# EAGLE board EEZ XMOS eval r1B5 (EAGLE 6.1), part 1 of 2
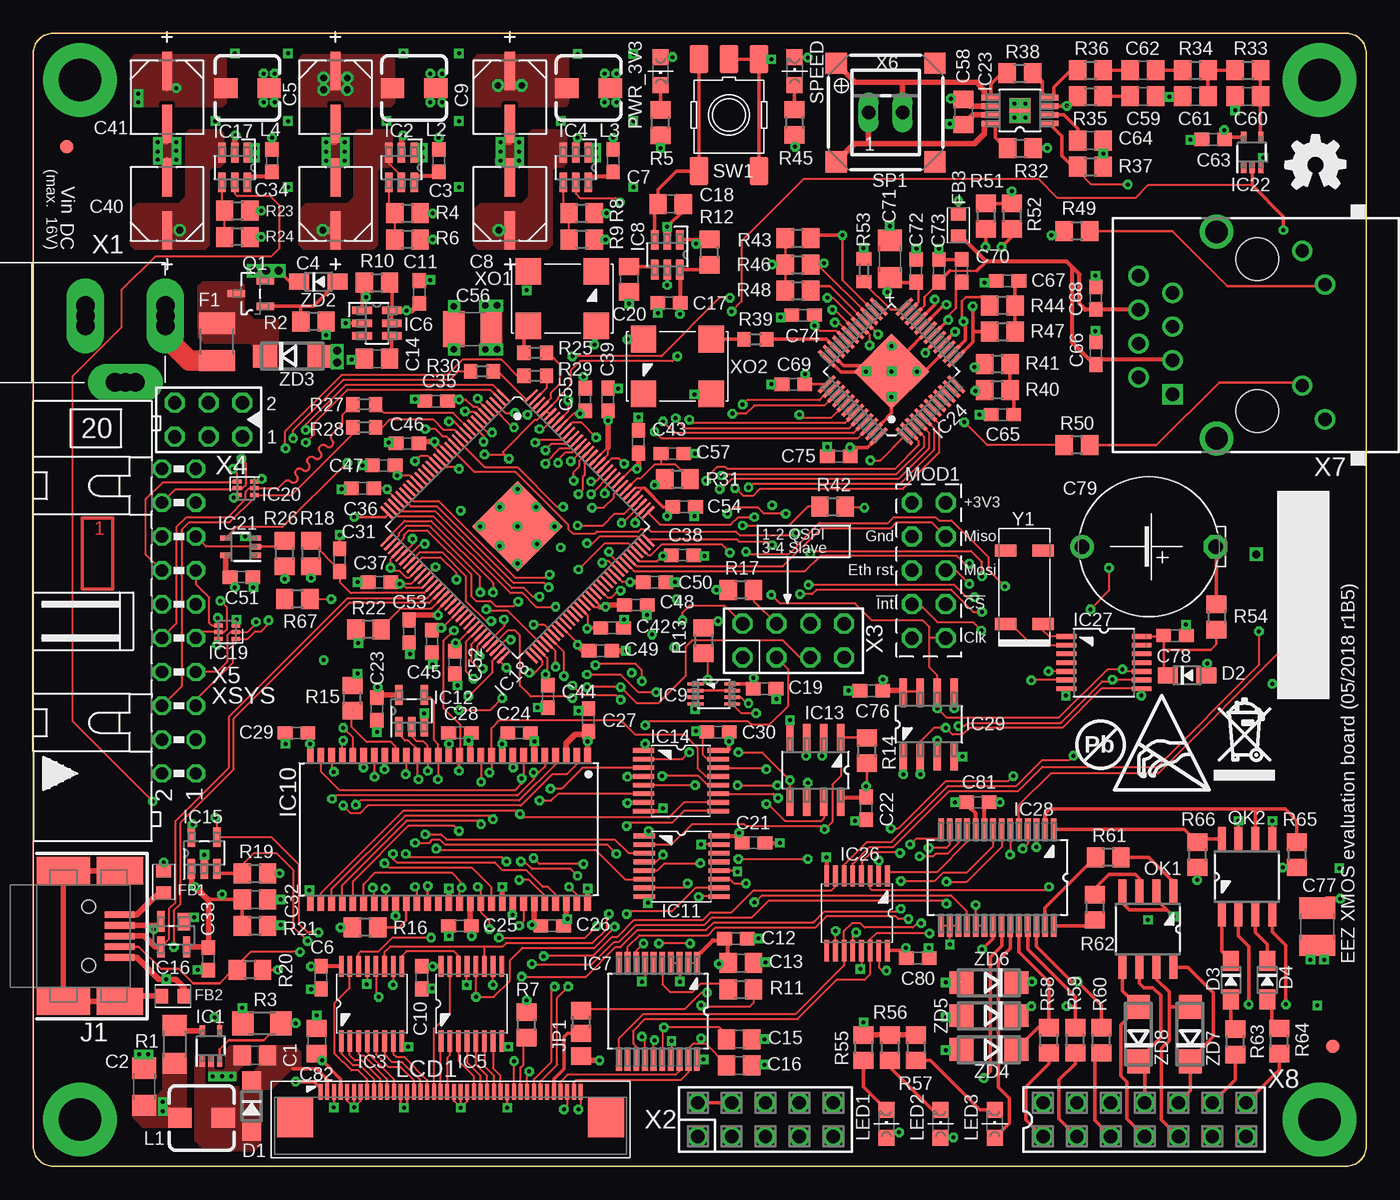
[diagram p5: board, top side]
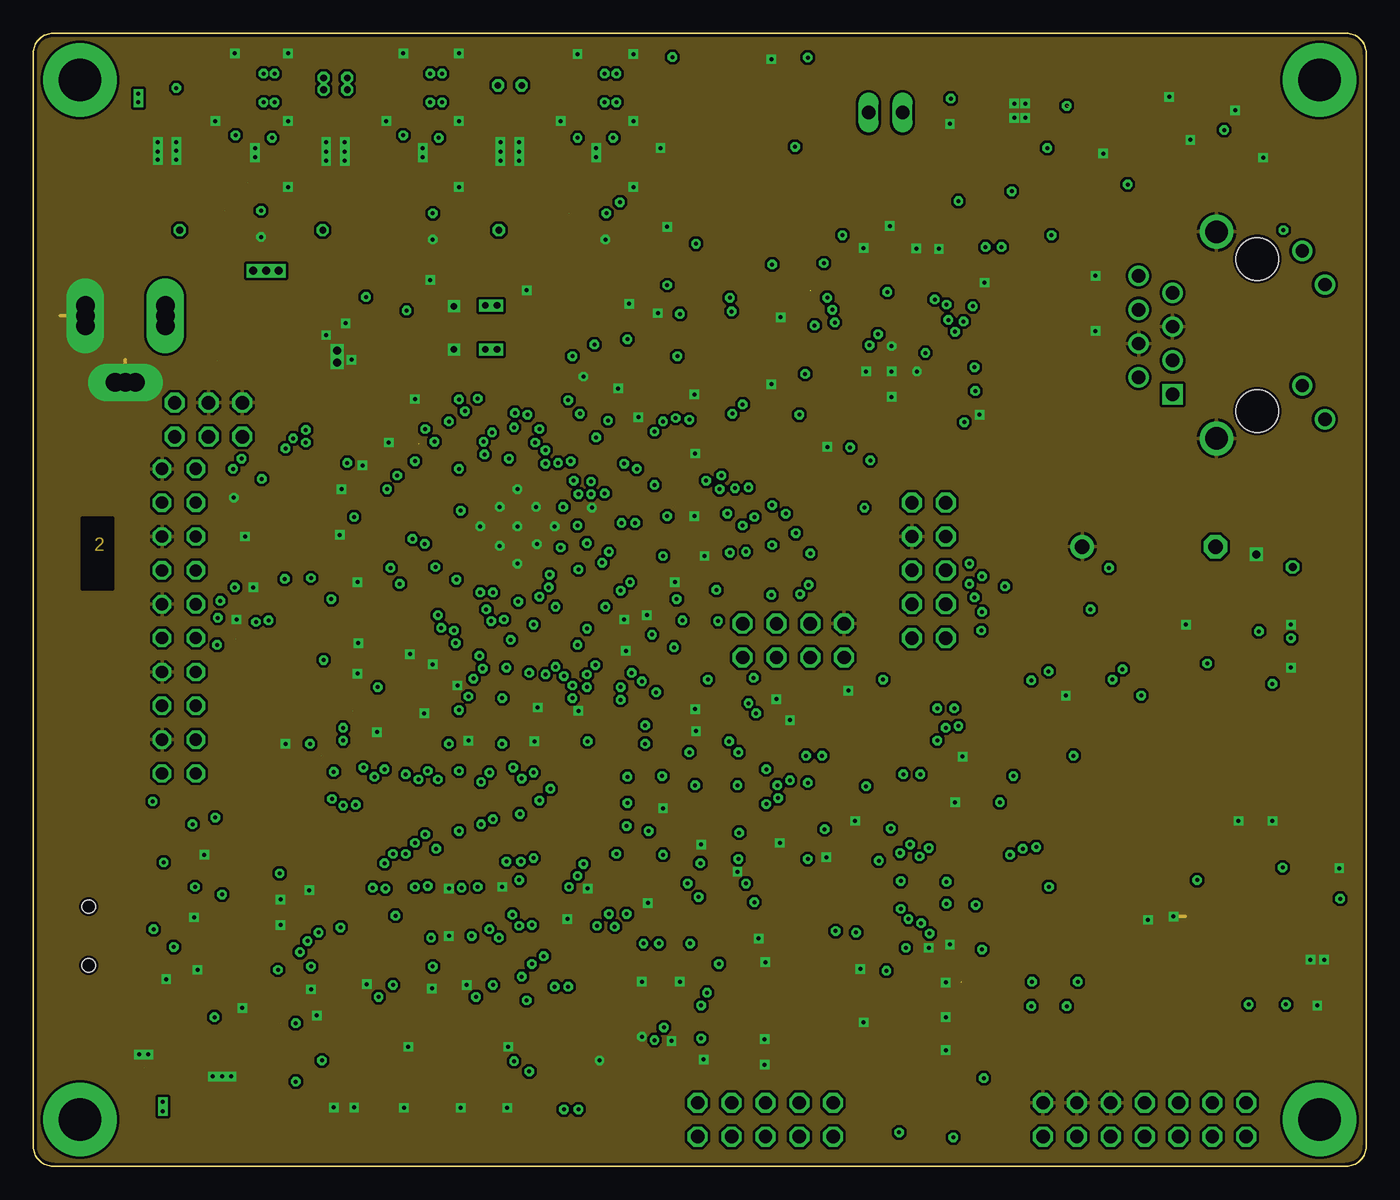
[diagram p6: board, inner layer Ground]
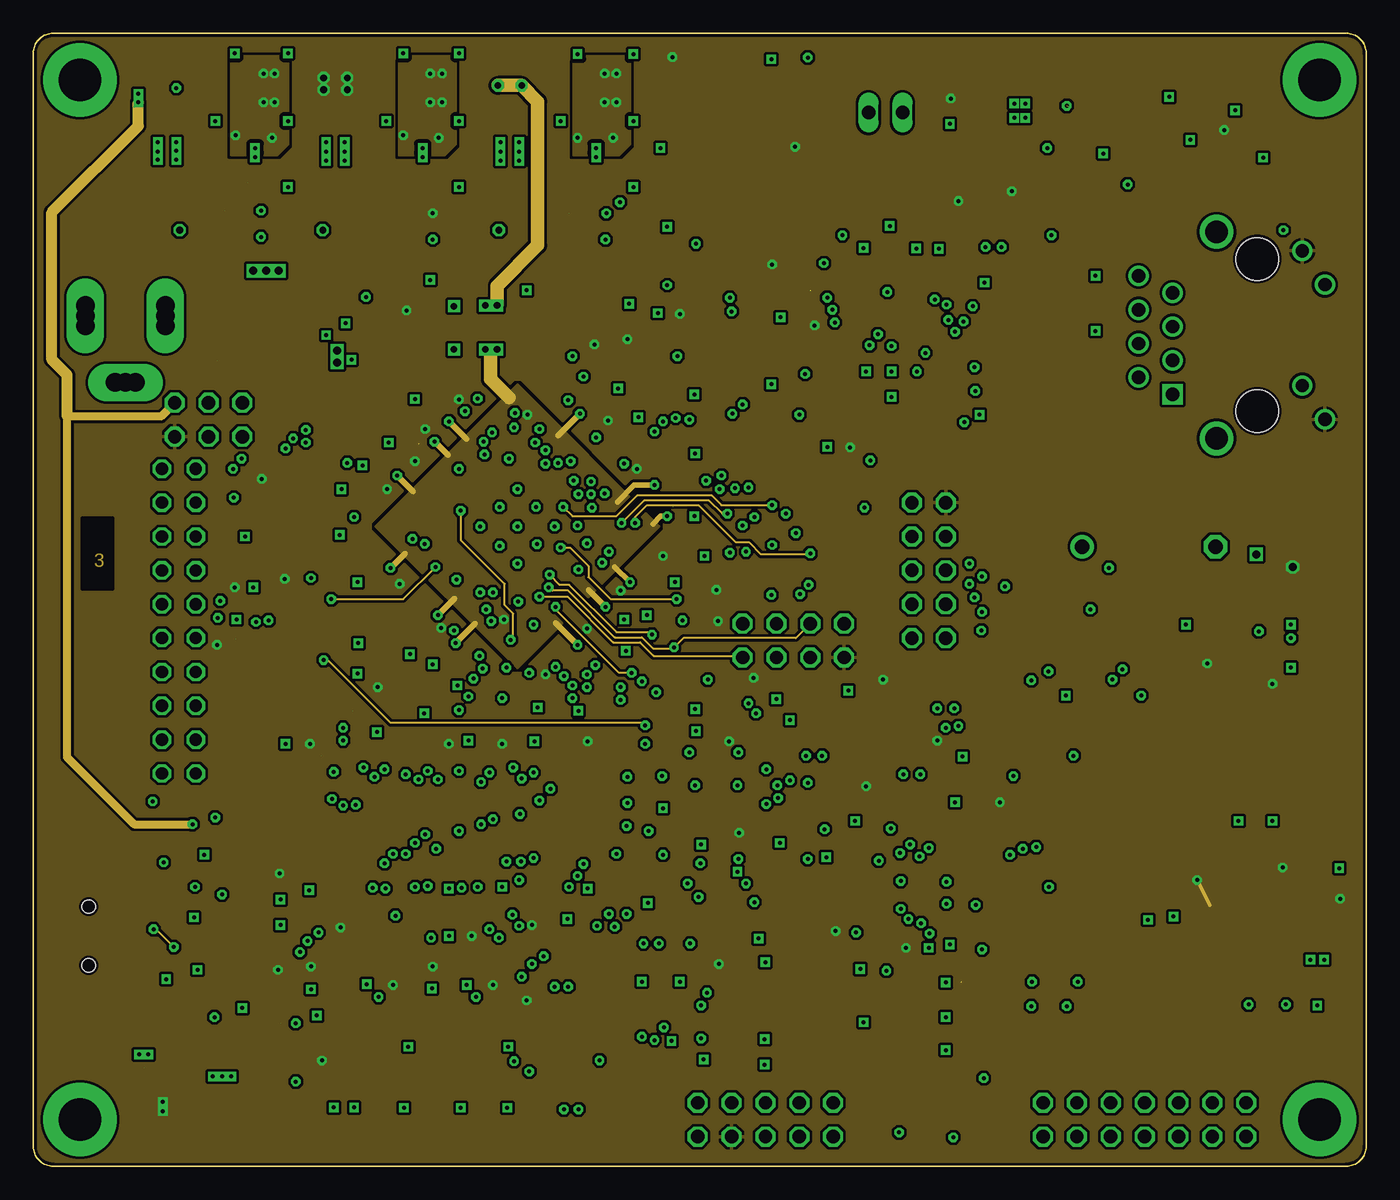
[diagram p7: board, inner layer Power]
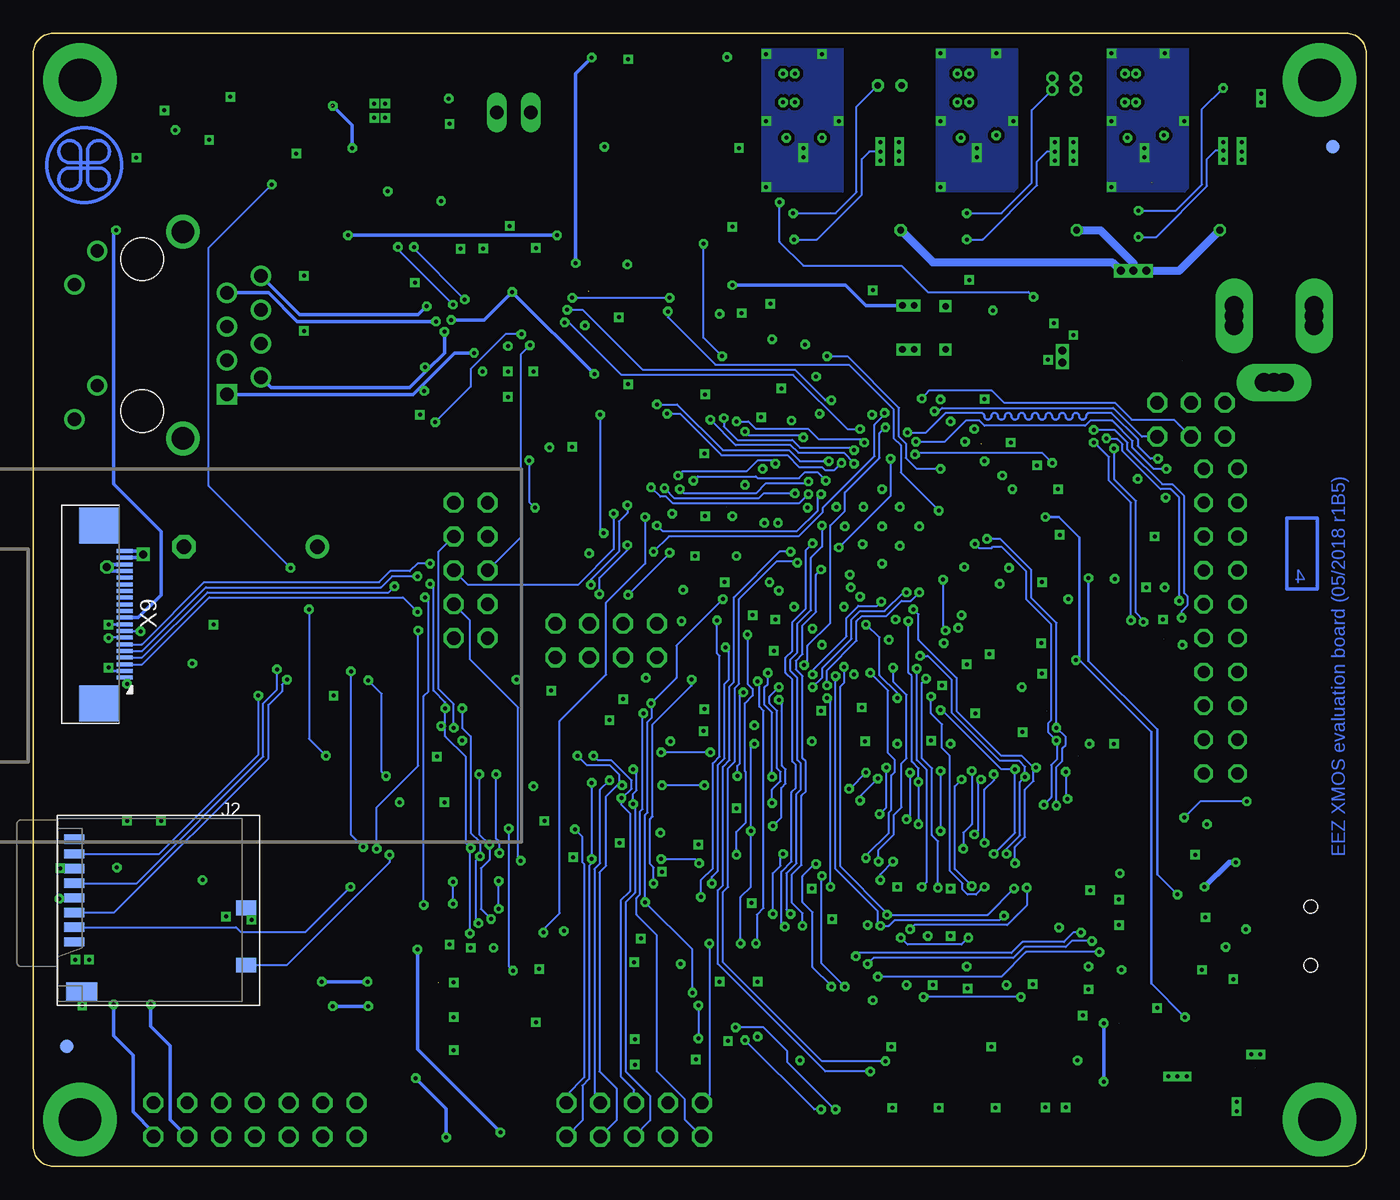
[diagram p8: board, bottom side, seen from below]

Size 100 x 85 mm. Coordinates in mm from the lower left corner, seen from the top.
Outline: 100,83.5 100,1.5 arc-90 98.5,0 1.5,0 arc-90 0,1.5 0,83.5 arc-90 1.5,85 98.5,85 arc-90 100,83.5
Copper layers (1*2*15*16): Top 0.035mm / dielectric 0.35mm / Ground 0.035mm / dielectric 0.71mm / Power 0.035mm / dielectric 0.35mm / Bottom 0.035mm
Design rules: minimum track width 6mil, minimum drill 11.5mil, track to track 6mil, track to pad 6mil, pad to pad 5mil, via to via 6mil, smd to smd 5mil, copper to edge 6mil, drill to drill 6mil, minimum pad ring 4mil, minimum via ring 8mil, stop-mask expansion 2mil, vias tented up to drill 25mil, thermal gap 8mil
Net classes: 0 default: width 0.152 mm, drill 0.3 mm, clearance 0.203 mm; 1 dgnd: width 0.152 mm, drill 0.3 mm, clearance 0.203 mm; 2 gnd: width 0.152 mm, drill 0.3 mm, clearance 0.203 mm

## Footprints (pad centres in the part's own frame; a part is rotated, then mirrored left to right if it is on the bottom)
C0805 = smd 1.3 x 1.5: 1 -0.95,0; 2 0.95,0
C1206 = smd 1.6 x 1.8: 1 -1.4,0; 2 1.4,0
C0603 = smd 1.1 x 1: 1 -0.85,0; 2 0.85,0
CAPAE530X610N = smd 2.87 x 0.762: 1 -1.981,0; 2 1.981,0
C1210 = smd 1.6 x 2.7: 1 -1.4,0; 2 1.4,0
EC1206 = smd 1.6 x 1.8: + -1.4,0; - 1.4,0
SG-R10MM = drill 1.1 pad 1.778 octagon: 1 5,0 | drill 1.1 pad 1.778: 2 -5,0
SOD123 = smd 1.4 x 1.4: A 1.9,0; C -1.9,0
SOD323-W = smd 1.5 x 1.2: A 1.45,0; C -1.45,0
F1210 = smd 1.6 x 2.7: 1 -1.4,0; 2 1.4,0
BEAD0603 = smd 1 x 1.1: P$1 -0.85,0; P$2 0.85,0
FIDUCIAL_DUAL = smd 1.016 x 1.016 bottom: B 0,0 | smd 1.016 x 1.016: T 0,0
DCK0005A_N = smd 0.85 x 0.4: 1 -1.125,0.65; 2 -1.125,0; 3 -1.125,-0.65; 4 1.125,-0.65; 5 1.125,0.65
DBV6 = smd 1.473 x 0.559: 1 -1.118,0.95; 2 -1.118,0; 3 -1.118,-0.95; 4 1.118,-0.95; 5 1.118,0; 6 1.118,0.95
PW(R-PDSO-G16) = smd 1.6 x 0.35: 1 -2.8,2.3; 2 -2.8,1.65; 3 -2.8,1; 4 -2.8,0.35; 5 -2.8,-0.3; 6 -2.8,-0.95; 7 -2.8,-1.6; 8 -2.8,-2.25; 9 2.8,-2.25; 10 2.8,-1.6; 11 2.8,-0.95; 12 2.8,-0.3; 13 2.8,0.35; 14 2.8,1; 15 2.8,1.65; 16 2.8,2.3
SOP65P780X200-20N = smd 1.651 x 0.432: 1 -3.632,2.921; 2 -3.632,2.286; 3 -3.632,1.626; 4 -3.632,0.965; 5 -3.632,0.33; 6 -3.632,-0.33; 7 -3.632,-0.965; 8 -3.632,-1.626; 9 -3.632,-2.286; 10 -3.632,-2.921; 11 3.632,-2.921; 12 3.632,-2.286; 13 3.632,-1.626; 14 3.632,-0.965; 15 3.632,-0.33; 16 3.632,0.33; 17 3.632,0.965; 18 3.632,1.626; 19 3.632,2.286; 20 3.632,2.921
DCU8 = smd 1.168 x 0.254: 1 -1.372,0.75; 2 -1.372,0.25; 3 -1.372,-0.25; 4 -1.372,-0.75; 5 1.372,-0.75; 6 1.372,-0.25; 7 1.372,0.25; 8 1.372,0.75
TSOPII-54 = smd 1.2 x 0.5: 1 -5.502,10.4; 2 -5.502,9.6; 3 -5.502,8.8; 4 -5.502,8; 5 -5.502,7.2; 6 -5.502,6.4; 7 -5.502,5.6; 8 -5.502,4.8; 9 -5.502,4; 10 -5.502,3.2; 11 -5.502,2.4; 12 -5.502,1.6; 13 -5.502,0.8; 14 -5.502,0; 15 -5.502,-0.8; 16 -5.502,-1.6; 17 -5.502,-2.4; 18 -5.502,-3.2; 19 -5.502,-4; 20 -5.502,-4.8; 21 -5.502,-5.6; 22 -5.502,-6.4; 23 -5.502,-7.2; 24 -5.502,-8; 25 -5.502,-8.8; 26 -5.502,-9.6; 27 -5.502,-10.4; 28 5.502,-10.4; 29 5.502,-9.6; 30 5.502,-8.8; 31 5.502,-8; 32 5.502,-7.2; 33 5.502,-6.4; 34 5.502,-5.6; 35 5.502,-4.8; 36 5.502,-4; 37 5.502,-3.2; 38 5.502,-2.4; 39 5.502,-1.6; 40 5.502,-0.8; 41 5.502,0; 42 5.502,0.8; 43 5.502,1.6; 44 5.502,2.4; 45 5.502,3.2; 46 5.502,4; 47 5.502,4.8; 48 5.502,5.6; 49 5.502,6.4; 50 5.502,7.2; 51 5.502,8; 52 5.502,8.8; 53 5.502,9.6; 54 5.502,10.4
DBV5 = smd 1.473 x 0.559: 1 -1.194,0.95; 2 -1.194,0; 3 -1.194,-0.95; 4 1.194,-0.95; 5 1.194,0.95
SOIC127P600X175-8N = smd 1.981 x 0.559: 1 -2.464,1.905; 2 -2.464,0.635; 3 -2.464,-0.635; 4 -2.464,-1.905; 5 2.464,-1.905; 6 2.464,-0.635; 7 2.464,0.635; 8 2.464,1.905
SOP192P292X122-4N = smd 0.94 x 1.321: 1 -0.762,-1.016 | smd 0.559 x 1.575: 2 0.965,-1.016; 3 0.965,0.889; 4 -0.965,0.889
TQ128 = smd 1.3 x 0.18: 1 -7.65,6.2; 2 -7.65,5.8; 3 -7.65,5.4; 4 -7.65,5; 5 -7.65,4.6; 6 -7.65,4.2; 7 -7.65,3.8; 8 -7.65,3.4; 9 -7.65,3; 10 -7.65,2.6; 11 -7.65,2.2; 12 -7.65,1.8; 13 -7.65,1.4; 14 -7.65,1; 15 -7.65,0.6; 16 -7.65,0.2; 17 -7.65,-0.2; 18 -7.65,-0.6; 19 -7.65,-1; 20 -7.65,-1.4; 21 -7.65,-1.8; 22 -7.65,-2.2; 23 -7.65,-2.6; 24 -7.65,-3; 25 -7.65,-3.4; 26 -7.65,-3.8; 27 -7.65,-4.2; 28 -7.65,-4.6; 29 -7.65,-5; 30 -7.65,-5.4; 31 -7.65,-5.8; 32 -7.65,-6.2; 65 7.65,-6.2; 66 7.65,-5.8; 67 7.65,-5.4; 68 7.65,-5; 69 7.65,-4.6; 70 7.65,-4.2; 71 7.65,-3.8; 72 7.65,-3.4; 73 7.65,-3; 74 7.65,-2.6; 75 7.65,-2.2; 76 7.65,-1.8; 77 7.65,-1.4; 78 7.65,-1; 79 7.65,-0.6; 80 7.65,-0.2; 81 7.65,0.2; 82 7.65,0.6; 83 7.65,1; 84 7.65,1.4; 85 7.65,1.8; 86 7.65,2.2; 87 7.65,2.6; 88 7.65,3; 89 7.65,3.4; 90 7.65,3.8; 91 7.65,4.2; 92 7.65,4.6; 93 7.65,5; 94 7.65,5.4; 95 7.65,5.8; 96 7.65,6.2 | smd 0.18 x 1.3: 33 -6.2,-7.65; 34 -5.8,-7.65; 35 -5.4,-7.65; 36 -5,-7.65; 37 -4.6,-7.65; 38 -4.2,-7.65; 39 -3.8,-7.65; 40 -3.4,-7.65; 41 -3,-7.65; 42 -2.6,-7.65; 43 -2.2,-7.65; 44 -1.8,-7.65; 45 -1.4,-7.65; 46 -1,-7.65; 47 -0.6,-7.65; 48 -0.2,-7.65; 49 0.2,-7.65; 50 0.6,-7.65; 51 1,-7.65; 52 1.4,-7.65; 53 1.8,-7.65; 54 2.2,-7.65; 55 2.6,-7.65; 56 3,-7.65; 57 3.4,-7.65; 58 3.8,-7.65; 59 4.2,-7.65; 60 4.6,-7.65; 61 5,-7.65; 62 5.4,-7.65; 63 5.8,-7.65; 64 6.2,-7.65; 97 6.2,7.65; 98 5.8,7.65; 99 5.4,7.65; 100 5,7.65; 101 4.6,7.65; 102 4.2,7.65; 103 3.8,7.65; 104 3.4,7.65; 105 3,7.65; 106 2.6,7.65; 107 2.2,7.65; 108 1.8,7.65; 109 1.4,7.65; 110 1,7.65; 111 0.6,7.65; 112 0.2,7.65; 113 -0.2,7.65; 114 -0.6,7.65; 115 -1,7.65; 116 -1.4,7.65; 117 -1.8,7.65; 118 -2.2,7.65; 119 -2.6,7.65; 120 -3,7.65; 121 -3.4,7.65; 122 -3.8,7.65; 123 -4.2,7.65; 124 -4.6,7.65; 125 -5,7.65; 126 -5.4,7.65; 127 -5.8,7.65; 128 -6.2,7.65 | smd 4.8 x 4.8: PAD 0,0
DRL6 = smd 0.654 x 0.301: 1 -0.65,0.5; 2 -0.65,0; 3 -0.65,-0.5; 4 0.65,-0.5; 5 0.65,0; 6 0.65,0.5
DCK5 = smd 0.85 x 0.4: 1 -1.125,0.65; 2 -1.125,0; 3 -1.125,-0.65; 4 1.125,-0.65; 5 1.125,0.65
SOP65P490X110-9N = smd 1.422 x 0.432: 1 -2.184,0.965; 2 -2.184,0.33; 3 -2.184,-0.33; 4 -2.184,-0.965; 5 2.184,-0.965; 6 2.184,-0.33; 7 2.184,0.33; 8 2.184,0.965 | smd 1.575 x 1.88: TP 0,0
PT48+PAD = smd 1.676 x 0.279: 1 -4.115,2.75; 2 -4.115,2.25; 3 -4.115,1.75; 4 -4.115,1.25; 5 -4.115,0.75; 6 -4.115,0.25; 7 -4.115,-0.25; 8 -4.115,-0.75; 9 -4.115,-1.25; 10 -4.115,-1.75; 11 -4.115,-2.25; 12 -4.115,-2.75; 25 4.115,-2.75; 26 4.115,-2.25; 27 4.115,-1.75; 28 4.115,-1.25; 29 4.115,-0.75; 30 4.115,-0.25; 31 4.115,0.25; 32 4.115,0.75; 33 4.115,1.25; 34 4.115,1.75; 35 4.115,2.25; 36 4.115,2.75 | smd 0.279 x 1.676: 13 -2.75,-4.115; 14 -2.25,-4.115; 15 -1.75,-4.115; 16 -1.25,-4.115; 17 -0.75,-4.115; 18 -0.25,-4.115; 19 0.25,-4.115; 20 0.75,-4.115; 21 1.25,-4.115; 22 1.75,-4.115; 23 2.25,-4.115; 24 2.75,-4.115; 37 2.75,4.115; 38 2.25,4.115; 39 1.75,4.115; 40 1.25,4.115; 41 0.75,4.115; 42 0.25,4.115; 43 -0.25,4.115; 44 -0.75,4.115; 45 -1.25,4.115; 46 -1.75,4.115; 47 -2.25,4.115; 48 -2.75,4.115 | smd 4 x 4: PAD 0,0
SOP65P640X120-14N = smd 1.473 x 0.356: 1 -2.819,1.956; 2 -2.819,1.295; 3 -2.819,0.66; 4 -2.819,0; 5 -2.819,-0.66; 6 -2.819,-1.295; 7 -2.819,-1.956; 8 2.819,-1.956; 9 2.819,-1.295; 10 2.819,-0.66; 11 2.819,0; 12 2.819,0.66; 13 2.819,1.295; 14 2.819,1.956
SOP65P780X200-28N = smd 1.651 x 0.432: 1 -3.632,4.216; 2 -3.632,3.581; 3 -3.632,2.921; 4 -3.632,2.286; 5 -3.632,1.626; 6 -3.632,0.965; 7 -3.632,0.33; 8 -3.632,-0.33; 9 -3.632,-0.965; 10 -3.632,-1.626; 11 -3.632,-2.286; 12 -3.632,-2.921; 13 -3.632,-3.581; 14 -3.632,-4.216; 15 3.632,-4.216; 16 3.632,-3.581; 17 3.632,-2.921; 18 3.632,-2.286; 19 3.632,-1.626; 20 3.632,-0.965; 21 3.632,-0.33; 22 3.632,0.33; 23 3.632,0.965; 24 3.632,1.626; 25 3.632,2.286; 26 3.632,2.921; 27 3.632,3.581; 28 3.632,4.216
678038020 = smd 2.25 x 0.5: 1 6.225,1.6; 2 6.225,0.8; 3 6.225,0; 4 6.225,-0.8; 5 6.225,-1.6 | smd 4 x 2.05: SH1 2,-4.9; SH2 2,4.9 | smd 3.5 x 2.05: SH1.1 6.25,-4.9; SH2.2 6.25,4.9 | hole 1: 3.9,2.2; 3.9,-2.2
5033981892 = smd 0.7 x 1.5: 1 4.45,12.6; 2 5.55,12.6; 3 6.65,12.6; 4 7.75,12.6; 5 8.85,12.6; 6 9.95,12.6; 7 11.05,12.6; 8 12.15,12.6 | smd 1.45 x 2.33: S 0.7,12.04 | smd 1.1 x 1.5: SW1 2.7,-0.3; SW2 7,-0.3
A0R-JMP = smd 1.5 x 1.3: 1 0,1.7; 2 0,0; 3 0,-1.7
DE0403 = smd 1.5 x 1.75: 1 0,1.626; 2 0,-1.625
FPC_40 = smd 0.3 x 1.2: 1 -9.75,1.9; 2 -9.25,1.9; 3 -8.75,1.9; 4 -8.25,1.9; 5 -7.75,1.9; 6 -7.25,1.9; 7 -6.75,1.9; 8 -6.25,1.9; 9 -5.75,1.9; 10 -5.25,1.9; 11 -4.75,1.9; 12 -4.25,1.9; 13 -3.75,1.9; 14 -3.25,1.9; 15 -2.75,1.9; 16 -2.25,1.9; 17 -1.75,1.9; 18 -1.25,1.9; 19 -0.75,1.9; 20 -0.25,1.9; 21 0.25,1.9; 22 0.75,1.9; 23 1.25,1.9; 24 1.75,1.9; 25 2.25,1.9; 26 2.75,1.9; 27 3.25,1.9; 28 3.75,1.9; 29 4.25,1.9; 30 4.75,1.9; 31 5.25,1.9; 32 5.75,1.9; 33 6.25,1.9; 34 6.75,1.9; 35 7.25,1.9; 36 7.75,1.9; 37 8.25,1.9; 38 8.75,1.9; 39 9.25,1.9; 40 9.75,1.9 | smd 2.7 x 3: Z1 -11.68,0; Z2 11.68,0
LED_0805 = smd 1.2 x 1.2: A 0,-1.05; C 0,1.05
ETH_W5500_MODULE = drill 1 pad 1.5 octagon: 1 -5.08,-2.54; 2 -5.08,-5.08; 3 -5.08,-7.62; 4 -5.08,-10.16; 5 -5.08,-12.7; 6 -2.54,-2.54; 7 -2.54,-5.08; 8 -2.54,-7.62; 9 -2.54,-10.16; 10 -2.54,-12.7
SO8-OPTO = smd 0.6 x 1.75: 1 -1.905,-2.85; 2 -0.635,-2.85; 3 0.635,-2.85; 4 1.905,-2.85; 5 1.905,2.85; 6 0.635,2.85; 7 -0.635,2.85; 8 -1.905,2.85
SOT95P237X112-3N = smd 1.321 x 0.559: 1 -1.092,0.94; 2 -1.092,-0.94; 3 1.092,0
R1206 = smd 1.6 x 1.803: 1 -1.422,0; 2 1.422,0
R0805 = smd 1.3 x 1.5: 1 -0.95,0; 2 0.95,0
R0603 = smd 1 x 1.1: 1 -0.85,0; 2 0.85,0
LD-BZEN-0803 = smd 1.6 x 1.6: + -3.7,3.7; - -3.7,-3.7; NC1 3.7,-3.7; NC2 3.7,3.7
TACTM-6XN = smd 2.1 x 1.4: 1 -4.2,2.25; 2 4.2,2.25; 3 -4.2,-2.25; 4 4.2,-2.25; 5 -4.2,0
DC-21MM = drill 1.4 pad 2.794 long: 1 -5.08,-3.353; 2 -0.076,-6.35; 3 -0.076,-0.356 | drill 1.4: 4 -5.08,-4.115; 5 -5.08,-2.591; 6 -0.838,-0.356; 7 0.686,-0.356; 8 -0.838,-6.35; 9 0.686,-6.35
SSW-105-02-S-D = drill 1 pad 1.5 octagon: 1 -5.08,-1.27; 2 -5.08,1.27; 3 -2.54,-1.27; 4 -2.54,1.27; 5 0,-1.27; 6 0,1.27; 7 2.54,-1.27; 8 2.54,1.27; 9 5.08,-1.27; 10 5.08,1.27
TSW-104-02-S-D-NONUM = drill 1 pad 1.5 octagon: 1 -3.81,-1.27; 2 -3.81,1.27; 3 -1.27,-1.27; 4 -1.27,1.27; 5 1.27,-1.27; 6 1.27,1.27; 7 3.81,-1.27; 8 3.81,1.27
TSW-103-07-F-D = drill 1 pad 1.5 octagon: 1 5.08,0; 2 5.08,2.54; 3 2.54,0; 4 2.54,2.54; 5 0,0; 6 0,2.54
ML20L = drill 0.914 octagon: 1 -11.43,-1.27; 2 -11.43,1.27; 3 -8.89,-1.27; 4 -8.89,1.27; 5 -6.35,-1.27; 6 -6.35,1.27; 7 -3.81,-1.27; 8 -3.81,1.27; 9 -1.27,-1.27; 10 -1.27,1.27; 11 1.27,-1.27; 12 1.27,1.27; 13 3.81,-1.27; 14 3.81,1.27; 15 6.35,-1.27; 16 6.35,1.27; 17 8.89,-1.27; 18 8.89,1.27; 19 11.43,-1.27; 20 11.43,1.27
22-23-2021 = drill 1 long: 1 -1.27,0; 2 1.27,0
RJ45-TRAFO-LED = drill 1 pad 1.524 square: 1 -4.445,6.35 | drill 1 pad 1.524: 2 -3.175,8.89; 3 -1.905,6.35; 4 -0.635,8.89; 5 0.635,6.35; 6 1.905,8.89; 7 3.175,6.35; 8 4.445,8.89; 9 -6.325,-5.08; 10 -3.785,-3.38; 11 3.785,-5.08; 12 6.325,-3.38 | drill 1.7 pad 2.54: SH1 -7.75,3.05; SH2 7.75,3.05 | hole 3.2: -5.715,0; 5.715,0
SSW-107-02-S-D = drill 1 pad 1.5 octagon: 1 -7.62,-1.27; 2 -7.62,1.27; 3 -5.08,-1.27; 4 -5.08,1.27; 5 -2.54,-1.27; 6 -2.54,1.27; 7 0,-1.27; 8 0,1.27; 9 2.54,-1.27; 10 2.54,1.27; 11 5.08,-1.27; 12 5.08,1.27; 13 7.62,-1.27; 14 7.62,1.27
FPC-20_ROTATED = smd 0.3 x 1.2: 1 4.75,2.217; 2 4.25,2.217; 3 3.75,2.217; 4 3.25,2.217; 5 2.75,2.217; 6 2.25,2.217; 7 1.75,2.217; 8 1.25,2.217; 9 0.75,2.217; 10 0.25,2.217; 11 -0.25,2.217; 12 -0.75,2.217; 13 -1.25,2.217; 14 -1.75,2.217; 15 -2.25,2.217; 16 -2.75,2.217; 17 -3.25,2.217; 18 -3.75,2.217; 19 -4.25,2.217; 20 -4.75,2.217 | smd 2.7 x 3: Z1 -6.68,0.318; Z2 6.68,0.318
12SMX(C) = smd 1.9 x 2: 1 -2.54,-2.05; 2 2.54,-2.05; 3 2.54,2.05; 4 -2.54,2.05
85SMX = smd 0.9 x 1.6: 1 -2.75,-1.4; 4 -2.75,1.4; NC.2 2.75,-1.4; NC.3 2.75,1.4
DO214AC = smd 1.8 x 1.7: A 2.05,0; C -2.05,0

## Placement (x,y rotation side)
C1  1u  [C0805]  16.64,8.32 180 top
C2  4u7  [C1206]  8.32,5.97 90 top
C3  100n  [C0603]  30.42,75.44 270 top
C4  EEEFK1V220R  [CAPAE530X610N]  22.67,72.2 90 top
C5  EEEFK1C470UR  [CAPAE530X610N]  22.67,80.2 270 top
C6  100n  [C0603]  21.59,14.16 90 top
C7  100n  [C0603]  43.5,75.44 270 top
C8  EEEFK1V220R  [CAPAE530X610N]  35.75,72.2 90 top
C9  EEEFK1C470UR  [CAPAE530X610N]  35.75,80.2 270 top
C10  100n  [C0603]  29.15,14.16 90 top
C11  100n  [C0603]  28.96,65.6 270 top
C12  100n  [C0603]  52.7,17.08 180 top
C13  1u  [C0805]  53.09,15.24 180 top
C14  120p  [C0805]  25.78,60.58 180 top
C15  10n  [C0805]  52.96,9.53 0 top
C16  10n  [C0805]  52.96,7.56 0 top
C17  100n  [C0603]  47.69,64.77 180 top
C18  10n  [C0805]  47.82,72.2 180 top
C19  100n  [C0603]  54.86,35.81 0 top
C20  120p  [C0805]  44.7,66.55 270 top
C21  100n  [C0603]  54.04,24.26 0 top
C22  100n  [C0603]  62.48,26.86 270 top
C23  100n  [C0603]  25.78,34.29 270 top
C24  100n  [C0603]  36.45,32.51 0 top
C25  100n  [C0603]  32,18.03 180 top
C26  100n  [C0603]  38.93,18.03 0 top
C27  100n  [C0603]  41.66,33.46 90 top
C28  100n  [C0603]  32,32.51 0 top
C29  100n  [C0603]  19.75,32.51 180 top
C30  100n  [C0603]  51.37,32.58 180 top
C31  100n  [C0603]  22.99,45.47 90 top
C32  2u2  [C0805]  16.64,20 0 top
C33  100n  [C0603]  13.14,15.56 90 top
C34  100n  [C0603]  17.91,75.44 270 top
C35  100n  [C0603]  30.23,57.4 180 top
C36  100n  [C0603]  24.7,50.86 180 top
C37  100n  [C0603]  25.97,43.81 180 top
C38  100n  [C0603]  48.7,45.85 0 top
C39  100n  [C0603]  43.12,57.53 90 top
C40  EEEFK1V220R  [CAPAE530X610N]  10.03,72.2 90 top
C41  EEEFK1C470UR  [CAPAE530X610N]  10.03,80.2 270 top
C42  100n  [C0603]  43.43,40.39 0 top
C43  100n  [C0603]  45.4,54.36 90 top
C44  100n  [C0603]  38.61,35.24 270 top
C45  100n  [C0603]  29.91,39.37 270 top
C46  100n  [C0603]  28.07,54.23 180 top
C47  100n  [C0603]  26.29,52.58 180 top
C48  100n  [C0603]  45.21,42.1 0 top
C49  100n  [C0603]  42.55,38.67 0 top
C50  100n  [C0603]  46.61,43.81 0 top
C51  100n  [C0603]  15.62,44.2 0 top
C52  100n  [C0603]  31.62,37.78 270 top
C53  100n  [C0603]  28.19,40.13 270 top
C54  100n  [C0603]  48.83,49.47 0 top
C55  100n  [C0603]  41.4,57.53 90 top
C56  10u  [C1210]  32.96,62.8 180 top
C57  100n  [C0603]  47.94,53.47 0 top
C58  1u  [C0805]  69.79,79.1 90 top
C59  470n  [C0805]  83.25,80.26 0 top
C60  4n7  [C0805]  91.12,80.26 180 top
C61  4n7  [C0805]  87.19,80.26 180 top
C62  470n  [C0805]  83.25,82.23 0 top
C63  100n  [C0603]  88.52,77.03 0 top
C64  220n  [C0805]  79.31,76.96 180 top
C65  100n  [C0603]  72.71,56.39 180 top
C66  100n  [C0603]  79.72,61 270 top
C67  100n  [C0603]  73.09,66.42 180 top
C68  100n  [C0603]  79.72,65.13 270 top
C69  100n  [C0603]  57.02,58.67 180 top
C70  100n  [C0603]  69.66,67.18 90 top
C71  10u  [EC1206]  64.26,68.07 90 top
C72  100n  [C0603]  66.23,67.18 90 top
C73  100n  [C0603]  67.94,67.18 90 top
C74  100n  [C0603]  57.76,63.86 180 top
C75  100n  [C0603]  60.43,53.25 180 top
C76  100n  [C0603]  62.87,35.69 180 top
C77  10u  [C1210]  96.33,17.97 270 top
C78  100n  [C0603]  85.66,39.81 180 top
C79  EECS0HD334H  [SG-R10MM]  83.69,46.48 0 top
C80  100n  [C0603]  66.36,15.62 180 top
C81  100n  [C0603]  70.87,27.3 180 top
C82  2u2  [C0805]  21.27,9.4 90 top
D1  NSR0240  [SOD123]  16.38,4.51 270 top
D2  BAS316  [SOD323-W]  86.55,36.83 0 top
D3  BAS316  [SOD323-W]  89.85,13.97 270 top
D4  BAS316  [SOD323-W]  92.58,13.97 270 top
EEZ_SIGNATURE  SIGNATURESMALL  [SIGNATURE_5MM]  96.19,75.1 180 top
F1  SM050-16 (500mA)  [F1210]  13.78,61.85 90 top
FB1  60R@100MHz  [BEAD0603]  9.78,21.34 270 top
FB2  60R@100MHz  [BEAD0603]  10.48,12.76 180 top
FB3  60R@100MHz  [BEAD0603]  69.41,70.61 270 top
FM1  FIDUCIAL_2  [FIDUCIAL_DUAL]  2.5,76.5 0 top
FM2  FIDUCIAL_2  [FIDUCIAL_DUAL]  97.5,9 0 top
IC1  TPS61169DCKR  [DCK0005A_N]  13.34,9.02 90 top
IC2  TPS561208DDCR  [DBV6]  27.62,74.93 270 top
IC3  74VHC595MTC  [PW(R-PDSO-G16)]  25.4,12.19 90 top
IC4  TPS561208DDCR  [DBV6]  40.7,74.93 270 top
IC5  74VHC595MTC  [PW(R-PDSO-G16)]  32.89,12.19 90 top
IC6  TPS3808G33DBVR  [DBV6]  25.78,63.25 0 top
IC7  AR1021-I/SS  [SOP65P780X200-20N]  46.86,11.62 270 top
IC8  TPS3808G09DBVR  [DBV6]  47.56,68.39 270 top
IC9  74AUP1G74DC.125  [DCU8]  51.05,35.43 0 top
IC10  IS42S16400J  [TSOPII-54]  31.18,25.27 270 top
IC11  SN74CBTLV3257  [PW(R-PDSO-G16)]  48.64,22.48 0 top
IC12  SN74LVC1G02DBVR  [DBV5]  28.38,34.16 90 top
IC13  AT25SF081-SSHDT  [SOIC127P600X175-8N]  58.67,29.72 270 top
IC14  SN74CBTLV3257  [PW(R-PDSO-G16)]  48.58,28.89 0 top
IC15  TPS2051BDBVR  [DBV5]  12.83,23.5 90 top
IC16  TPD2E001DZDR  [SOP192P292X122-4N]  10.54,17.34 180 top
IC17  TPS561208DDCR  [DBV6]  15.11,74.93 270 top
IC18  XE216-512-TQ128-C20  [TQ128]  36.32,48.01 315 top
IC19  TPD4E001DRLR  [DRL6]  14.54,40.07 180 top
IC20  TPD4E001DRLR  [DRL6]  15.94,50.86 0 top
IC21  74LVC1G07SE-7  [DCK5]  15.56,46.48 180 top
IC22  74LVC1G07SE-7  [DCK5]  91.44,76.07 90 top
IC23  TPA6205A1DGN  [SOP65P490X110-9N]  74.02,79.21 180 top
IC24  DP83848CVV/NOPB  [PT48+PAD]  64.39,59.63 135 top
IC26  74VHC595MTC  [PW(R-PDSO-G16)]  61.79,18.99 270 top
IC27  PCA21125T/Q900/1,1  [SOP65P640X120-14N]  80.33,37.78 0 top
IC28  MCP23S17-E/SS  [SOP65P780X200-28N]  72.33,21.65 270 top
IC29  M95256-WMN6P  [SOIC127P600X175-8N]  67.18,33.15 90 top
J1  678038020  [678038020]  0.25,17.27 0 top
J2  5033981892  [5033981892]  84.33,12.38 90 bottom
JP1  0R-JUMPA  [A0R-JMP]  41.08,9.97 0 top
L1  DLG-0403-4R7  [DE0403]  12.64,3.62 90 top
L2  DLG-0403-2R2  [DE0403]  28.57,80.9 270 top
L3  DLG-0403-2R2  [DE0403]  41.66,80.9 270 top
L4  DLG-0403-2R2  [DE0403]  16.07,80.9 270 top
LCD1  PCA-6-LA-40-HL-3  [FPC_40]  31.31,3.68 0 top
LED1  HSMY-C170  [LED_0805]  64.01,3.17 0 top
LED2  HSMY-C170  [LED_0805]  68.07,3.17 0 top
LED3  HSMY-C170  [LED_0805]  72.14,3.17 0 top
MOD1  ZL262-10DG  [ETH_W5500_MODULE]  63.37,52.32 0 bottom
OK1  MOCD217M  [SO8-OPTO]  83.63,17.78 180 top
OK2  MOCD217M  [SO8-OPTO]  91.06,21.72 0 top
PWR_3V3  HSMY-C170  [LED_0805]  47.05,82.17 180 top
Q1  IRLML2246TRPBF  [SOT95P237X112-3N]  16.32,65.47 180 top
R1  10R  [R1206]  10.6,9.14 90 top
R2  0R  [R0805]  21.02,63.37 180 top
R3  10R  [R1206]  17.14,10.73 180 top
R4  15K  [R0805]  28.07,71.5 0 top
R5  180R  [R0805]  47.05,78.3 90 top
R6  4K7  [R0805]  28.07,69.53 180 top
R7  10K  [R0805]  37.02,10.6 90 top
R8  2K7  [R0805]  41.15,71.5 0 top
R9  10K  [R0805]  41.15,69.53 180 top
R10  47K  [R0805]  25.78,66.29 0 top
R11  20K  [R0805]  53.09,13.27 0 top
R12  47K  [R0805]  50.74,68.58 90 top
R13  10K  [R0805]  50.29,39.43 270 top
R14  1K  [R0805]  62.55,31.18 90 top
R15  10K  [R0805]  23.94,35.12 90 top
R16  10K  [R0805]  24.89,17.91 180 top
R17  3K3  [R0805]  53.09,43.24 180 top
R18  4K7  [R0805]  20.83,45.97 90 top
R19  47K  [R0805]  16.64,21.97 0 top
R20  47K  [R0805]  16.26,14.73 180 top
R21  47K  [R0805]  16.64,18.03 0 top
R22  43R2  [R0805]  25.15,40.26 180 top
R23  5K6  [R0805]  15.3,71.69 0 top
R24  1K  [R0805]  15.3,69.72 180 top
R25  33R  [R0603]  37.66,61.02 0 top
R26  47K  [R0805]  18.86,45.97 90 top
R27  33R  [R0603]  24.83,57.15 180 top
R28  33R  [R0603]  24.83,55.44 180 top
R29  33R  [R0603]  37.66,59.31 180 top
R30  33R  [R0603]  33.66,59.63 180 top
R31  4R7  [R0805]  48.32,51.56 0 top
R32  20K  [R0805]  74.05,76.38 0 top
R33  1K  [R0805]  91.12,82.23 0 top
R34  1K  [R0805]  87.19,82.23 0 top
R35  10K  [R0805]  79.31,80.26 0 top
R36  10K  [R0805]  79.31,82.23 0 top
R37  47K  [R0805]  79.31,74.99 0 top
R38  20K  [R0805]  74.02,82 0 top
R39  33R  [R0603]  54.17,62.04 0 top
R40  49R9  [R0805]  72.33,58.23 180 top
R41  49R9  [R0805]  72.33,60.2 0 top
R42  22R  [R0805]  59.97,49.49 0 top
R43  2K2  [R0805]  57.37,69.62 0 top
R44  49R9  [R0805]  72.71,64.58 180 top
R45  180R  [R0805]  57.12,78.32 90 top
R46  2K2  [R0805]  57.37,67.65 0 top
R47  49R9  [R0805]  72.71,62.61 0 top
R48  2K2  [R0805]  57.37,65.68 0 top
R49  180R  [R0805]  78.3,70.17 180 top
R50  180R  [R0805]  78.3,54.1 180 top
R51  2K2  [R0805]  71.46,71.29 270 top
R52  2K2  [R0805]  73.43,71.29 270 top
R53  4K87  [R0603]  62.32,67.22 270 top
R54  180R  [R0805]  88.77,41.21 270 top
R55  470R  [R0805]  62.29,8.89 270 top
R56  470R  [R0805]  64.26,8.89 270 top
R57  470R  [R0805]  66.23,8.89 270 top
R58  470R  [R0805]  76.2,9.46 90 top
R59  470R  [R0805]  78.17,9.46 90 top
R60  470R  [R0805]  80.14,9.46 90 top
R61  220R  [R0805]  80.64,23.18 180 top
R62  220R  [R0805]  79.63,19.43 270 top
R63  470R  [R0805]  90.17,9.33 90 top
R64  470R  [R0805]  93.47,9.4 90 top
R65  1K  [R0805]  94.81,23.37 270 top
R66  1K  [R0805]  87.31,23.37 270 top
R67  N.C.  [R0805]  19.81,42.55 180 top
SP1  LD-BZEN-0803  [LD-BZEN-0803]  63.94,79.06 0 top
SPEED  HSMY-C170  [LED_0805]  57.12,82.17 0 top
SW1  1301.9316  [TACTM-6XN]  52.2,78.87 270 top
U$1  [RECYCLE_BIN1/8]  88.59,28.96 0 top
U$5  [PB_SMALL]  80.07,31.62 180 top
U$6  [ESD_SYMBOL]  81.11,28.22 0 top
X1  FC68149  [DC-21MM]  3.56,63.88 90 top
X2  SSW-105-02-S-D  [SSW-105-02-S-D]  54.93,3.49 0 top
X3  TSW-104-02-S-D_NN  [TSW-104-02-S-D-NONUM]  57.02,39.43 0 top
X4  TSW-103-07-F-D  [TSW-103-07-F-D]  10.6,54.74 0 top
X5  ZL231-20KG  [ML20L]  10.92,40.89 90 top
X6  22-23-2021  [22-23-2021]  63.94,79.06 0 top
X7  LMJTAB881243M-L  [RJ45-TRAFO-LED]  91.82,62.36 90 top
X8  SSW-107-02-S-D  [SSW-107-02-S-D]  83.38,3.49 0 top
X9  PCA-6G-20-HL-3 or 52746-2071  [FPC-20_ROTATED]  95.38,41.4 270 bottom
XO1  CFPS-73-24M  [12SMX(C)]  39.69,65.09 180 top
XO2  CFPS-73-25M  [12SMX(C)]  48.32,60.01 0 top
Y1  XTAL016178- 85SMX  [85SMX]  74.36,43.43 90 top
ZD2  [SOD323-W]  21.4,66.36 0 top
ZD3  P4SMAJ16A-DIO  [DO214AC]  19.43,60.77 0 top
ZD4  P4SMAJ5.0A-DIO  [DO214AC]  71.69,8.76 180 top
ZD5  P4SMAJ5.0A-DIO  [DO214AC]  71.69,11.3 180 top
ZD6  P4SMAJ5.0A-DIO  [DO214AC]  71.69,13.78 180 top
ZD7  P4SMAJ16A-DIO  [DO214AC]  86.8,9.91 90 top
ZD8  P4SMAJ16A-DIO  [DO214AC]  82.93,9.91 90 top

## Tracks (layer width: path | path; a pad name or v marks a point on that pad's centre or on a via)
1V0_EN  (via drill 0.3)
  Top 0.152: IC4.5 40.7,72.96 41.02,72.64 43.69,72.64 v44.01,72.33 | v24.96,65.22 24.7,65.09 | 24.7,65.09 24.64,65.15 | 24.7,65.09 24.66,65.09
  Top 0.254: IC6.1 24.66,65.09 24.66,66.13 R10.1
  Bottom 0.152: 25.08,65.34 v24.96,65.22 25.34,65.6 32.89,65.6 34.86,67.56 42.23,67.56 44.01,69.34 v44.01,72.33
!AUDIO_SHDN  (via drill 0.3)
  Top 0.152: IC26.6 60.84,22.61 62.55,24.32 64.39,24.32 68.58,28.51 73.72,28.51 75.69,30.48 77.72,30.48 v78.04,30.8 | v82.11,73.66 79.38,73.66 78.36,74.68 R37.1 | v80.71,44.9 80.71,43.18 v79.31,41.78
  Top 0.254: R37.1 77.98,74.99 77.15,75.82 77.15,77.29 IC23.1
  Bottom 0.152: v80.71,44.9 86.87,51.05 86.87,68.9 v82.11,73.66 | v79.31,41.78 79.31,32.07 v78.04,30.8
!QSPI_CS  (via drill 0.3)
  Top 0.152: IC11.2 47.88,24.13 49.4,25.65 53.34,25.65 53.47,25.53 59.12,25.53 v59.37,25.27 59.94,25.84 59.94,28.64 60.58,29.27 IC13.1
  Top 0.203: IC13.1 62.49,32.18 R14.2
  Bottom 0.152: X2.10 60.01,5.33 58.67,6.67 58.67,22.67 58.8,22.8 58.8,24.7 v59.37,25.27
!QSPI_SEL  (via drill 0.3)
  Top 0.152: v46.16,25.15 45.85,24.77 IC11.1 | v49.28,16.7 v46.93,16.7 | IC14.1 45.78,31.68 v45.91,31.69
  Top 0.254: X2.4 X2.2
  Bottom 0.152: v46.93,16.7 46.93,20.19 46.16,20.95 v46.16,25.15 46.16,31.43 v45.91,31.69 | v49.28,16.7 49.28,5.33 X2.2
!RESET  (via drill 0.3)
  Top 0.152: v49.72,69.22 49.72,69.53 50.7,69.53 R12.2 | IC28.18 70.04,19.11 68.83,20.32 54.67,20.32 54.17,19.81 v54.1,19.81 | v23.56,52.77 23.5,52.77 18.67,47.94 15.24,47.94 IC21.4 | 39.37,57.56 39.37,57.66 40.32,58.61 40.32,59.69 41.02,60.39 47.94,60.39 v48.32,60.77 | v33.85,53.4 35.24,53.4 | 35.24,53.4 35.37,53.4 v35.69,53.09 | 35.24,53.4 35.24,53.59 37.62,55.97 37.78,55.97 IC18.124 | IC18.123 | IC18.123 IC18.124 | 39.37,57.56 | 39.37,57.56 IC18.124 | IC9.6 53.08,35.18 53.53,34.73 v53.66,34.73 | JP1.1 41.23,11.81 48.9,11.81 50.1,13.02 v50.55,13.02
  Top 0.254: IC8.1 50.72,69.51 R12.2
  Power 0.152: v48.26,42.55 43.31,42.55 41.66,44.2 41.66,45.02 40.26,46.42 v39.56,46.42
  Bottom 0.152: v49.72,69.22 49.72,62.17 v48.32,60.77 | v23.56,52.77 24.32,53.53 33.72,53.53 v33.85,53.4 | v35.69,53.09 35.69,50.29 v39.56,46.42 | v48.26,42.55 51.75,39.05 51.75,36.64 v53.66,34.73 53.59,34.67 53.59,33.66 53.91,33.34 53.91,26.54 54.1,26.35 v54.1,19.81 50.55,16.26 v50.55,13.02
!RIVERDI_INT  (via drill 0.3)
  Top 0.152: IC28.5 73.95,27.09 76.33,29.46 84.39,29.46 94.36,39.43 v94.36,39.62
  Bottom 0.152: X9.7 94.36,39.65 v94.36,39.62
!RIVERDI_PD  (via drill 0.3)
  Top 0.152: IC26.5 61.49,22.69 62.74,23.94 64.52,23.94 68.71,28.13 73.85,28.13 75.69,29.97 84.33,29.97 91.95,37.59 v91.95,40.13
  Bottom 0.152: v91.95,40.13 93.14,40.13 X9.8
!RTC_INT  (via drill 0.3)
  Top 0.152: v75.25,23.94 IC28.3 | IC27.5 v76.17,37.12
  Bottom 0.152: v75.25,23.94 76.17,24.87 v76.17,37.12
!SD_CAS  (via drill 0.3)
  Top 0.152: IC12.1 27.43,32.38 27.88,31.94 28.13,31.94 28.78,31.29 IC10.17 28.78,29.13 v28.89,29.02 | v29.4,24.89 30.61,24.89 30.99,24.51 43.62,24.51 44.64,23.5 45.83,23.5 IC11.3
  Bottom 0.152: v28.89,29.02 29.15,28.77 29.15,25.15 v29.4,24.89
!SD_DETECT  (via drill 0.3)
  Top 0.152: IC28.6 73.29,23.38 v73.28,23.37
  Bottom 0.152: v73.28,23.37 73.28,22.8 80.99,15.08 J2.SW1
!SD_RAS  (via drill 0.3)
  Top 0.152: IC10.18 27.98,29.44 v27.94,29.4 | v28.64,24.26 29.72,24.26 29.97,24.51 30.48,24.51 30.86,24.13 43.05,24.13 v43.75,23.43 | IC11.10 49.67,20.88 47.9,19.11 44.7,19.11 v44.51,18.92
  Bottom 0.152: v44.51,18.92 44.51,21.97 43.94,22.54 43.94,23.24 v43.75,23.43 | v28.64,24.26 28.64,28.26 27.94,28.96 v27.94,29.4
!SD_WE  (via drill 0.3)
  Top 0.152: v29.59,29.65 29.58,29.67 IC10.16 29.58,31.57 29.27,31.88 28.77,31.88 28.45,32.19 28.45,32.91 IC12.2 | IC11.6 44.39,21.53 42.16,23.75 30.35,23.75 30.29,23.81 v30.23,23.81
  Bottom 0.152: v29.59,29.65 29.59,25.65 30.23,25.02 v30.23,23.81
!SPI1_EEPROM  (via drill 0.3)
  Top 0.152: IC26.4 62.17,21.82 62.17,22.86 62.87,23.56 64.96,23.56 v65.02,23.5 | v65.28,29.4 IC29.1
  Bottom 0.152: v65.02,23.5 65.02,24.32 65.28,24.57 v65.28,29.4
!SPI1_IOEXP
  Top 0.152: IC26.1 64.08,21.98 64.2,22.1 67.82,22.1 70.04,24.32 IC28.11
!SPI1_RTC  (via drill 0.3)
  Top 0.152: IC27.6 74.91,36.49 v74.87,36.45 | IC26.15 63.44,14.92 63.69,14.67 v64.01,14.67 | v73.53,29.27 73.15,28.89 68.45,28.89 64.9,25.34 v64.33,25.34
  Bottom 0.152: v73.53,29.27 73.85,29.59 73.85,35.43 v74.87,36.45 | v64.33,25.34 64.33,14.99 v64.01,14.67
!SPI1_SDCARD  (via drill 0.3 pad 0.25)
  Top 0.152: IC26.3 62.78,20.84 62.93,20.7 75.95,20.7 v76.2,20.95
  Bottom 0.152: v76.2,20.95 78.93,18.22 79.22,17.93 79.57,17.59 84.45,17.59 84.8,17.93 J2.2
!SPI1_TOUCH  (via drill 0.3)
  Top 0.152: IC18.4 35.96,55.44 v36.07,55.44 | IC7.8 45.24,16.15 v45.78,16.7 | v42.16,37.59 42.29,37.72 45.15,37.72 45.66,37.21 v45.66,36.39
  Bottom 0.152: v45.78,16.7 45.72,16.76 45.72,18.86 45.21,19.37 45.21,34.16 45.53,34.48 45.53,36.26 v45.66,36.39 | v42.16,37.59 42.1,37.59 41.91,37.78 41.91,39.05 40.2,40.77 40.2,48.07 39.12,49.15 39.12,50.55 36.51,53.15 36.51,54.99 v36.07,55.44
!SPI1_W5500  (via drill 0.3)
  Top 0.152: IC26.2 63.44,22.73 v63.44,22.92
  Bottom 0.152: v63.44,22.92 63.63,23.05 63.63,34.42 67.25,38.04 67.25,40.96 MOD1.4
!USB_OC  (via drill 0.3)
  Top 0.152: R19.1 15.69,22.61 16.57,23.5 18.22,23.5 19.49,22.23 19.49,17.97 v20.57,16.89 | IC28.7 72.66,23.95 70.04,21.34 v68.52,21.34 | v37.4,15.18 37.47,15.11 41.85,15.11 43.56,16.83 43.94,16.83 45.21,18.1 50.35,18.1 50.93,18.67 53.91,18.67 55.18,19.94 68.26,19.94 v68.52,19.68
  Top 0.203: 13.65,22.3 IC15.3
  Top 0.254: R19.1 13.65,21.97 IC15.3
  Bottom 0.152: v20.57,16.89 22.1,16.89 22.54,16.45 25.65,16.45 26.48,15.62 36.96,15.62 v37.4,15.18 | v68.52,19.68 v68.52,21.34
!W5500_INT  (via drill 0.3)
  Top 0.152: IC28.4 74.61,24.19 v74.23,23.81 | MOD1.9 66.48,42.16 67.82,40.83 70.48,40.83 v71.12,40.2
  Bottom 0.152: v74.23,23.81 74.23,26.92 71.12,30.04 v71.12,40.2
+1V0  (via drill 0.3, 0.5)  (3 unrouted)
  Top 0.152: IC18.126 v37.07,56.39 | v44.77,43.81 44.19,43.81 IC18.87 | IC18.36 26.8,45.55 v26.8,44.9 27.05,44.64 27.5,44.64 28,44.13 28.21,44.13 IC18.41 | IC18.60 35.31,40.48 v35.31,41.02 | IC18.120 40.52,56.45 v41,56.45 41.24,56.26 C55.1 | IC18.101 45.66,50.84 45.66,50.93 | IC18.102 45.18,50.93 45.66,50.93 | IC18.16 30.19,54.42 v30.1,54.36 30.1,53.95 IC18.17 | IC18.11 31.56,55.88 v31.18,55.88 | v40.83,39.12 40.83,39.26 IC18.73 | IC18.24 28.27,51.82 v27.3,51.82 | R8.2 v42.99,71.5 | IC18.81 42.42,42.19 42.42,41.97 | IC18.80 42.07,41.97 42.42,41.97 | 42.42,41.97 v42.93,41.97 | IC18.49 30.35,41.75 v30.35,41.34 | IC18.56 31.8,39.24 v31.69,39.24 31.69,38.7 C52.1 | 45.66,50.93 45.78,50.93 45.85,50.86 | C54.1 47.56,49.05 v47.56,48.77
  Top 0.254: IC8.5 v47.56,66.1 | 45.85,50.86 47.24,49.47 48.01,49.47 | v33.91,64.58 v34.8,64.58
  Top 0.305: C53.1 28.22,41.05 28.51,41.34
  Top 0.406: C48.1 43.05,42.1 v42.93,41.97 42.51,41.97 | R31.1 46.87,51.12 v46.61,51.12 | 28.51,41.34 v30.35,41.34 | C49.1 41.27,38.67 v40.83,39.12 | v27.3,51.82 27.3,52.49 27.27,52.49 C47.1 | v34.8,61.28 v34.8,64.58 34.8,62.99 34.61,62.8 C56.1 | C9.1 35.75,81.09 | v30.1,54.36 29.08,54.36 28.89,54.17 | v44.77,43.81 C50.1
  Top 0.61: v36.64,81.09 35.75,81.09
  Power 0.406: v26.8,44.9 27.88,45.97 | 28.51,50.61 v27.3,51.82 | 31.11,53.34 v30.1,54.36 | 32.51,54.55 v31.18,55.88 | 41.02,56.45 39.37,54.8 | v46.61,51.12 45.09,51.12 43.81,49.85 | v47.56,48.77 47.05,48.77 46.48,48.2 | 41.66,43.24 v42.93,41.97 | 43.62,44.96 v44.77,43.81 | v31.69,39.24 33.15,40.7 | v30.35,41.34 31.62,42.61 | 39.18,40.77 v40.83,39.12
  Power 0.508: v33.91,61.28 34.29,60.52 34.29,60.83 v34.8,61.28
  Power 0.61: 34.8,64.64 v34.8,64.58
  Power 0.914: v34.8,64.58 33.97,64.58 | v34.8,61.28 v33.91,61.28
  Power 1.016: 35.69,57.66 34.29,59.05 34.29,60.83 | v34.86,81.09 v36.64,81.09 37.85,79.88 37.85,69.09 34.8,66.04 34.8,64.64
  Bottom 0.152: v42.99,71.5 39.81,71.5 38.23,73.09 38.23,79.5 v36.64,81.09
  Bottom 0.254: v47.56,66.1 39.05,66.1 37.53,64.58 v34.8,64.58
  pour Power (isolate 0.203, no thermals): 36.32,58.67 46.99,48.01 36.32,37.34 25.65,48.01
  pour Top (isolate 0.254, no thermals): 33.02,79.76 33.02,83.06 33.34,83.38 39.81,83.38 40.13,83.06 40.13,79.76 39.88,79.5 33.27,79.5
+1V0_SW  (via drill 0.3)
  Top 0.406: IC4.2 40.7,77.03 v40.83,77.15 | C7.1 v43.5,77.15 | v43.75,79.82 43.75,80.43 L3.1
  other vias: 42.86,79.82 42.86,81.98 43.75,81.98
  pour Power (isolate 0.305, no thermals): 40.83,83.31 44.45,83.31 44.77,82.99 44.77,76.64 43.94,75.82 40.51,75.82 40.51,82.99
+3V3  (via drill 0.3, 0.5, 0.6)
  Top 0.152: IC18.52 30.68,40.39 v30.61,40.39 30.07,40.39 C45.1 | IC18.92 45.43,45.4 46.8,45.4 v47.24,45.78 C38.1 | IC18.29 26.54,50.71 v26.54,50.8 26.48,50.86 C36.1 | IC18.111 43.08,53.91 43.12,53.91 43.12,53.39 IC18.110 | v34.48,13.59 34.48,14.98 IC5.10 | IC3.10 27,13.6 v26.99,13.59 | IC26.10 60.19,17.64 v60.2,17.65 | IC29.3 v67.82,31.94 | R7.2 v37.02,12.45 | IC18.19 29.64,53.28 29.02,53.28 v28.64,52.9 28.89,53.15 | IC18.14 31,54.74 30.73,54.74 30.16,55.31 v29.4,55.31 | IC18.83 43.07,42.67 43.37,42.67 43.88,43.18 v44.07,43.18 | IC18.67 38.54,38.15 38.54,37.02 v38.43,36.91 38.61,36.73 C44.1 | R4.2 v29.97,71.5 | IC18.78 41.59,41.32 41.59,40.39 | IC18.6 33.31,56.96 33.02,56.96 32.45,57.53 v31.94,57.53 | C35.1 31.2,57.34 | v17.14,51.56 17.04,51.37 IC20.6 | v13.78,39.12 13.78,39.46 IC19.6 | R17.2 v51.24,43.24 | IC18.42 28.33,43.69 v27.5,43.69 | IC18.44 29.14,43.37 28,43.37 27.69,43.69 v27.5,43.69 | C37.1 26.95,43.69 v27.5,43.69 | v45.28,52.32 44.88,52.32 IC18.105 | 60.93,62.01 60.26,62.67 59.02,62.67 v58.61,63.08 | IC7.2 IC7.1
  Top 0.203: v58.61,63.08 C74.1 | v55.44,67.65 R46.1 | R46.1 R48.1 | R46.1 R43.1 | v57.15,76.48 57.15,77.35 R45.1 | v88.08,37.72 88.08,36.89 D2.A | IC29.8 IC29.7 | C76.1 63.72,36.47 v63.75,36.51 | v23.05,17.91 R16.2 | IC24.32 60.93,62.01 | v18.48,21.97 R19.2 | R20.1 v18.35,14.73 | IC9.2 IC9.7 IC9.8 | R14.1 62.55,28.57 v62.48,28.51
  Top 0.254: R66.2 v87.31,21.46 | R65.2 v93.73,22.42 | IC22.5 89.54,77.2 | 89.54,77.2 C63.2 | v89.34,77.75 89.34,77.34 89.49,77.2 89.54,77.2 | IC8.6 50.12,67.27 R12.1 | IC6.5 IC6.6 | IC6.6 26.9,66.12 R10.2 | IC24.48 62.59,53.94 v61.28,53.94 61.28,53.75 C75.1 | FB3.P$1 v69.41,72.42 | R26.1 v18.86,44.07 | IC5.16 v29.98,14.99 v29.97,14.99 | IC26.16 65.27,16.19 v65.47,16.38 65.51,16.34 C80.2 | IC9.8 53.65,36.18 C19.1 54.04,35.84 v54.04,36.64 | v51.37,40.89 50.29,40.89 R13.1 | LCD1.4 23.05,6.54 v21.65,7.94 21.65,8.07 C82.1 | R51.1 R52.1 73.43,73.13 v73.41,73.15
  Top 0.305: IC8.6 48.51,64.8 C17.1 | IC3.16 21.61,14.99 C6.2 20.85,15.01 v20.83,14.99 | IC11.16 52.97,24.78 v52.96,25.02 52.93,24.49 C21.1 | 49.85,15.75 49.78,15.68 IC7.1 49.78,15.75 50.99,16.95 51.73,16.95 C12.2 52.14,16.8 C13.2 52.07,15.18 v51.44,15.18 | IC13.8 60.58,27.62 60.64,27.69 62.46,27.69 C22.1 v62.48,28.51 | C30.1 52.22,31.9 v52.2,31.88 52.2,31.3 52.08,31.19 IC14.16 | v72.52,27.3 C81.1 71.36,26.9 IC28.9 | PWR_3V3.A v47.93,83.22 v47.94,83.21 | C42.1 41.59,40.39 v41.54,40.34
  Top 0.406: IC23.6 70.29,79.54 C58.2 69.73,80.1 v68.83,80.1 | C76.1 65.2,35.69 IC29.8 | IC10.43 32.78,18.11 C25.1 v32.89,17.27 | v37.4,18.1 37.82,18.1 C26.1 37.58,18.34 IC10.49 | C28.1 31.15,31.71 v31.18,31.69 IC10.14 | IC10.9 v35.18,31.69 | v35.18,31.69 | IC10.27 20.78,31.67 v20.77,31.69 20.77,32.35 C29.1 | IC12.5 26,35.36 C23.1 25.84,35.2 v25.84,35.94 | IC6.6 v28,64.2 28.41,64.2 C11.2 | v48.51,63.94 48.51,64.75 C17.1 | v42.1,61.66 XO1.4 | v44.58,62.04 XO2.4 | C39.1 v43.12,55.94 43.12,53.91 | IC21.5 14.43,44.53 C51.1 14.99,44.2 15.11,44.07 v15.11,43.43 | IC10.3 39.98,31.72 40.64,32.38 41.78,32.38 | 41.78,32.38 41.85,32.45 41.95,32.45 C27.1 | v35.18,31.69 35.18,32.09 C24.1 | C10.2 29.95,15.01 v29.97,14.99 | IC10.1 41.58,31.99 v41.59,31.88 41.59,32.32 41.78,32.38 | 31.2,57.34 31.39,57.53 v31.94,57.53 | C43.1 45.4,52.45 v45.28,52.32 | C77.1 97.03,20.07 v98.04,20.07
  Power 0.254: v87.31,21.46 88.27,19.56
  Bottom 0.152: v29.97,71.5 27.37,71.5 25.08,73.79 25.08,79.25 v23.56,80.77
  Bottom 0.203: v92.96,36.2 92.96,36.46 X9.1
  Bottom 0.254: X9.18 94.29,45.15 v94.49,44.96 94.18,44.65 X9.17
  Bottom 0.406: v98.04,20.07 97,20.07 J2.4
  other vias: 9.72,4.13 9.72,4.83 21.78,80.77 23.56,81.66 21.78,81.66
  pour Power (isolate 0.203, rank 3): 0,84.84 99.82,84.84 99.82,0.25 0,0.25
  pour Top (isolate 0.203, no thermals): 7.49,5.14 9.14,5.14 9.78,5.78 9.78,7.24 11.43,7.24 11.43,2.92 8.26,2.92 7.49,3.68
  pour Top (isolate 0.254, no thermals): 19.94,79.76 19.94,83.06 20.26,83.38 26.73,83.38 27.05,83.06 27.05,79.76 26.8,79.5 20.19,79.5
+3V3(A)
  Top 0.152: 68.77,67.18 70.8,67.18
  Top 0.203: IC24.22 66.86,64.58 66.86,65.22 67.94,66.29
  Top 0.254: 67.94,66.29 C73.1 67.94,66.36 68.77,67.18 | 70.8,67.18 71.5,67.88
  Top 0.305: X7.3 85.41,60.52 79.35,60.52 | X7.6 79.73,64.26 | 79.73,64.26 C68.2 | 77.92,67.5 77.92,61.85 79.25,60.52 79.35,60.52 | 79.73,64.26 78.93,64.26 78.49,64.71 78.49,66.93 77.92,67.5 | 77.92,67.5 77.53,67.88 71.5,67.88 69.62,69.76 FB3.P$2 | 79.82,60.52 79.72,60.41 C66.2 79.35,60.52
+3V3_SW  (via drill 0.3)
  Top 0.406: v29.78,79.82 29.78,80.48 L2.1 | C3.1 v30.42,77.15 | IC2.2 27.62,77.22 v27.75,77.34
  other vias: 30.67,79.82 29.78,81.98 30.67,81.98
  pour Power (isolate 0.305, no thermals): 27.75,83.31 31.37,83.31 31.69,82.99 31.69,76.64 30.86,75.82 27.43,75.82 27.43,82.99
+5V  (via drill 0.3)
  Top 0.152: R23.2 v17.08,71.69 | v10.73,80.9 10.03,80.9 10.03,80.71
  Top 0.406: v11.94,25.65 11.94,24.75 IC15.5
  Top 0.61: v7.87,79.82 7.94,79.88
  Power 0.61: v11.94,25.65 7.56,25.65 2.54,30.67 2.54,56.33 2.6,56.26 9.59,56.26 X4.6 | v7.87,79.82 v7.87,80.45
  Power 0.813: 2.54,56.33 2.54,59.37 1.4,60.52 1.4,71.56 7.87,78.04 v7.87,79.82
  Bottom 0.152: v17.08,71.69 14.29,71.69 12.32,73.66 12.32,79.31 v10.73,80.9
  pour Top (isolate 0.254, no thermals): 7.3,79.76 7.3,83.06 7.62,83.38 14.1,83.38 14.41,83.06 14.41,79.76 14.16,79.5 7.56,79.5
+5V_SW  (via drill 0.3)
  Top 0.406: IC17.2 15.11,77.28 v15.18,77.34 | C34.1 v17.91,77.15 | v17.27,79.82 17.27,80.48 L4.1
  other vias: 18.1,79.82 17.27,81.98 18.1,81.98
  pour Power (isolate 0.305, no thermals): 15.18,83.31 18.8,83.31 19.11,82.99 19.11,76.64 18.29,75.82 14.86,75.82 14.86,82.99
AUDIO_OUT  (via drill 0.3)
  Top 0.152: IC18.62 35.45,39.5 v35.81,39.5 | 91.44,73.6 83.63,73.6 82.68,72.64 76.83,72.64 75.44,74.04 57.78,74.04 53.15,69.41 53.15,64.9 v52.39,64.14
  Top 0.254: IC22.2 91.44,73.6 93.79,71.25 v93.79,70.23
  Power 0.152: v35.81,39.5 36.01,39.69 36.01,41.47 35.37,42.1 35.37,43.69 32.07,46.99 v32.07,49.19
  Bottom 0.152: v52.39,64.14 52.39,63.69 48.83,60.13 38.8,60.13 35.43,56.77 35.43,54.61 34.92,54.1 34.92,52.05 v32.07,49.19
  Bottom 0.254: v93.79,70.23 93.98,70.04 93.98,51.18 90.42,47.62 90.42,42.86 92.14,41.15 X9.10
ETH_MDC  (via drill 0.3)
  Top 0.152: IC24.31 61.27,62.36 61.27,62.42 60.39,63.31 v60.13,63.31 | v37.97,55.31 38.25,55.31 IC18.122
  Bottom 0.152: v37.97,55.31 38.92,55.31 42.99,59.37 55.88,59.37 59.82,63.31 v60.13,63.31
ETH_MDIO  (via drill 0.3)
  Top 0.152: v40.13,57.47 40.13,56.62 IC18.121 | IC24.30 60.11,64.26 v59.94,64.26
  Bottom 0.152: v40.13,57.47 40.58,57.47 42.86,59.75 54.29,59.75 58.8,64.26 v59.94,64.26
ETH_RST  (via drill 0.3)
  Top 0.152: v62.74,61.59 62.74,62.42 62.09,63.07 IC24.29 62.01,63.15 60.01,65.15 v59.56,65.15 | v52.26,65.15 51.5,65.15 47.12,60.77 v40.45,60.77 | v31.94,52.32 31.81,52.45 31.03,52.45 IC18.18
  Bottom 0.152: v62.74,61.59 63.44,60.9 63.44,47.18 MOD1.8 | v59.56,65.15 v52.26,65.15 | v31.94,52.32 33.72,52.32 34.54,53.15 34.54,54.23 35.05,54.74 35.05,56.9 38.92,60.77 v40.45,60.77
ETH_RX0  (via drill 0.3)
  Top 0.152: IC24.43 61.66,56.51 60.9,55.75 49.47,55.75 v49.21,56.01 | IC18.116 40.63,54.29 40.2,53.85 39.5,53.85 38.42,52.77 v38.42,52.7
  Bottom 0.152: v38.42,52.7 38.42,52.77 39.18,53.53 42.61,53.53 43.18,54.1 47.31,54.1 v49.21,56.01
ETH_RX1  (via drill 0.3)
  Top 0.152: IC24.44 62.01,56.17 61.21,55.37 48.9,55.37 48.2,56.07 v48.2,56.13 | 40.35,54.58 IC18.117 40,54.23 40,54.22 39.94,54.17 38.86,54.17 v38.42,53.72
  Bottom 0.152: v48.2,56.13 48.2,55.5 47.18,54.48 43.05,54.48 42.48,53.91 38.61,53.91 v38.42,53.72
ETH_RX2  (via drill 0.3)
  Top 0.152: IC24.45 61.53,54.99 48.13,54.99 v47.24,55.88 | 39.94,54.74 | 39.94,54.74 39.69,54.48 37.85,54.48 v37.66,54.29 | 39.94,54.74 IC18.118
  Bottom 0.152: v47.24,55.88 46.35,55.88 45.78,55.31 41.85,55.31 41.08,54.55 37.91,54.55 v37.66,54.29
ETH_RX3  (via drill 0.3)
  Top 0.152: IC24.46 61.85,54.61 47.12,54.61 v46.61,55.12 | 39.78,55.15 IC18.119 40.46,55.82 41.08,55.82 v42.23,54.67
  Bottom 0.152: v46.61,55.12 46.35,54.86 42.42,54.86 v42.23,54.67
ETH_RX_CLK  (via drill 0.3)
  Top 0.152: IC24.38 59.83,58.31 58.99,57.47 53.53,57.47 v53.21,57.15 | IC18.114 40.36,52.9 v40.32,52.9
  Bottom 0.152: 40.7,52.9 v40.32,52.9 42.48,52.9 43.31,53.72 48.26,53.72 51.69,57.15 v53.21,57.15
ETH_RX_CTL  (via drill 0.3)
  Top 0.152: IC24.39 59.37,57.09 54.1,57.09 53.47,56.45 v52.45,56.45 | IC18.115 40.43,53.53 39.88,53.53 39.37,53.02 v39.37,52.77
  Bottom 0.152: v39.37,52.77 39.94,52.2 40.58,52.2 40.83,52.45 42.55,52.45 43.43,53.34 48.39,53.34 51.5,56.45 v52.45,56.45 52.13,56.45
ETH_RX_ER  (via drill 0.3)
  Top 0.152: IC24.41 59.84,56.13 57.66,56.13 57.53,56.26 v57.47,56.39 | IC18.15 33.11,52.07 36.2,52.07 40.13,48.13 40.13,47.82 40.51,47.43 42.1,47.43 42.29,47.62 45.41,47.62 45.61,47.82 46.16,47.82 46.35,47.62 52.7,47.62 53.02,47.31 57.02,47.31 v57.21,47.5
  Bottom 0.152: v57.47,56.39 57.47,47.75 v57.21,47.5
ETH_TX0  (via drill 0.3)
  Top 0.152: IC24.3 66.8,54.74 66.8,53.98 64.77,51.94 51.75,51.94 v51.63,51.82 | IC18.109 43.38,53.09 43.94,53.09 v44.32,52.7
  Bottom 0.152: v44.32,52.7 44.58,52.96 45.66,52.96 46.48,52.13 51.31,52.13 v51.63,51.82
ETH_TX1  (via drill 0.3)
  Top 0.152: IC24.4 67.18,55.05 67.18,53.85 64.9,51.56 52.39,51.56 51.63,50.8 v51.5,50.8 | IC18.108 42.23,51.37 v41.85,51.37
  Bottom 0.152: v51.5,50.8 51.18,50.48 45.78,50.48 45.02,51.24 41.97,51.24 v41.85,51.37
ETH_TX2  (via drill 0.3)
  Top 0.152: IC18.107 41.91,50.48 v41.85,50.42 | 66.77,56.17 IC24.5 67.56,55.39 67.56,53.72 65.02,51.18 53.91,51.18 v53.66,50.93
  Bottom 0.152: v53.66,50.93 52.96,50.23 52.51,50.23 52.01,49.72 42.55,49.72 v41.85,50.42
ETH_TX3  (via drill 0.3)
  Top 0.152: 43.46,51.47 IC18.106 42.86,50.87 v42.86,50.48 | 67.19,56.51 67.12,56.51 IC24.6 67.94,55.72 67.94,53.53 65.22,50.8 54.48,50.8 53.98,50.29 53.28,50.29 52.7,50.86 v52.64,50.86
  Bottom 0.152: v42.86,50.48 45.21,50.48 45.59,50.1 51.88,50.1 v52.64,50.86
ETH_TX_CLK  (via drill 0.3)
  Top 0.152: IC24.1 65.35,54.75 | v62.36,49.4 61.01,49.4 R42.2 | IC24.1 65.35,54.79 65.02,55.12 | v62.8,52.96 63.54,52.96 IC24.1
  Bottom 0.152: v62.8,52.96 62.8,49.85 v62.36,49.4
ETH_TX_CTL  (via drill 0.3)
  Top 0.152: IC24.2 65.71,55.07 65.77,55.07 66.42,54.42 66.42,54.1 64.64,52.32 52.07,52.32 51.94,52.45 51.31,52.45 50.48,51.63 v50.48,51.44 | IC18.113 40.96,52.92 40.96,52.51 40.55,52.1 v40.55,51.44
  Bottom 0.152: v40.55,51.44 41.18,52.07 42.1,52.07 42.55,51.63 45.66,51.63 45.78,51.75 50.16,51.75 v50.48,51.44
FRM1
  Top 0.254: 3.68,48.64 5.97,48.64 5.97,43.31 3.68,43.31 3.68,48.64
FRM2
  cutout Ground: 5.97,43.31 3.68,43.31 3.68,48.64 5.97,48.64
FRM3
  cutout Power: 5.97,43.31 3.68,43.31 3.68,48.64 5.97,48.64
FRM4
  Bottom 0.254: 3.68,48.64 5.97,48.64 5.97,43.31 3.68,43.31 3.68,48.64
GND  (via drill 0.3, 0.5, 0.6)  (2 unrouted)
  Top 0.152: v37.02,65.72 37.02,67.01 XO1.2 | IC18.104 43.56,50.44 43.56,50.16 42.8,49.4 v41.91,49.4 | v32.51,13.59 32.51,14.96 IC5.13 | v29.91,13.34 C10.1 | IC3.13 25.05,13.68 v25.02,13.65 | v46.1,19.75 45.78,20.17 IC11.8 | v40.07,18.54 40.01,18.26 C26.2 | v31.18,17.27 31.18,18.01 C25.2 | 47.82,7.94 47.83,7.95 IC7.17 47.88,8.04 v47.88,9.4 | IC7.20 v50.29,8 | C16.2 v54.86,7.62 | C15.2 v54.86,9.53 | IC7.14 45.9,9.47 v45.66,9.72 | IC11.15 50.42,24.13 v50.1,24.13 | 51.4,22.23 IC11.12 52.75,22.18 v52.83,22.1 | IC28.17 IC28.16 | IC28.15 68.12,18.03 68.71,18.03 68.72,18.02 IC28.16 | C80.1 67.21,16.36 v67.18,16.38 | IC7.7 45.9,14.08 v45.66,13.84 | IC14.15 50.55,30.54 50.23,30.86 50.23,32.28 C30.2 v49.72,32.64 | IC28.16 68.75,16.66 v68.77,16.64 | IC26.13 62.14,14.89 v62.04,14.8 | v77.47,35.31 77.53,35.8 IC27.7 | v49.66,34.29 49.66,34.66 IC9.4 | C19.2 55.71,35.01 v55.75,35.05 | v68.45,11.18 69.51,11.18 ZD5.A | v68.45,8.7 69.58,8.7 ZD4.A | v8.64,8.38 8.64,7.81 8.32,7.49 C2.2 | R3.2 15.72,11.84 v15.68,11.87 | R6.1 v29.97,69.53 | R9.1 v42.93,69.53 | R24.1 v17.08,69.72 | IC20.3 15.06,50.36 v15.05,50.16 | IC19.3 15.19,40.97 v15.24,41.02 | 24.83,60.45 C14.2 | v49.59,48.77 49.59,49.38 C54.2 | v41.27,59.24 41.4,59.24 C55.2 | IC7.4 IC7.3
  Top 0.203: LCD1.13 27.55,4.64 v27.81,4.38 28.05,4.62 LCD1.14 | LCD1.22 32.06,4.39 v32.07,4.38 | LCD1.23 32.56,4.87 v32.07,4.38 | LCD1.21 31.55,4.89 v32.07,4.38 | LCD1.29 v35.56,4.39 v35.56,4.38 | IC3.8 27.65,8.95 v28.13,8.95 | IC5.8 35.14,8.95 v35.62,8.95 | v24.07,4.41 LCD1.6 | LCD1.7 24.55,4.9 v24.07,4.41 | LCD1.5 23.55,4.92 v24.07,4.41 | LCD1.3 22.55,4.42 v22.54,4.41 | C64.1 v80.26,75.98 R37.2 | R53.1 62.32,68.87 v62.29,68.9 | v56.07,63.69 56.88,63.88 C74.2 | C78.1 86.51,40.62 v86.49,40.64 | v61.15,35.69 C76.2 | v69.72,30.73 69.14,30.73 IC29.4 | C69.2 v55.37,58.67 | v48.51,13.84 48.51,15.23 IC7.3 | v56.77,33.47 IC13.4
  Top 0.254: OK1.2 84.26,20 v85.53,18.73 85.03,19.24 82.23,19.24 81.72,19.75 OK1.4 | v90.42,25.91 OK2.7 | v92.96,25.91 OK2.5 | R55.1 v62.29,10.79 | C59.2 85.19,80.26 v85.22,80.24 85.24,80.26 C61.2 | IC22.3 92.09,75.53 v92.27,75.67 | v90.17,79.22 C60.2 | v86.81,77 87.64,77 C63.1 | SW1.5 SW1.1 | v55.37,83.06 54.46,83.06 SW1.1 | IC8.2 v47.56,70.48 48.77,71.69 C18.1 | SW1.2 SW1.1 | v44.7,64.71 C20.2 | v46.86,64.01 46.86,64.75 C17.2 | IC24.47 64.39,56.52 v64.39,57.72 64.45,57.72 | IC24.35 60.77,60.07 62.04,60.07 v62.48,59.63 | 62.36,59.5 v62.48,59.63 | IC24.36 59.55,60.59 60.58,59.56 62.42,59.56 v62.48,59.63 | C71.- v64.26,70.55 | v23.43,63.25 IC6.2 | v23.88,60.52 24.7,60.52 24.83,60.39 24.83,60.45 | v59.56,53.98 59.56,53.27 C75.2 | C68.1 79.72,66.78 v79.69,66.8 | C70.2 C73.2 v67.94,68.83 | C72.2 66.23,68.85 v66.24,68.86 | IC24.19 65.34,60.93 | 65.34,60.93 65.34,60.77 | IC24.15 66.93,59.69 66.86,59.69 66.8,59.63 v66.29,59.63 | 65.34,60.93 64.74,61.53 v64.39,61.53 | C65.2 v70.99,56.39 | v71.37,66.29 72.14,66.29 72.24,66.4 | 72.24,66.4 72.26,66.42 | C67.2 72.24,66.4 | C32.2 v18.54,20 | R21.2 18.48,18.03 v18.54,18.1 | C31.2 v22.99,47.37 | v24.32,36.96 R15.2 | C29.2 18.9,31.71 v18.92,31.69 | v29.34,33.97 29.35,32.96 IC12.3 | v24.38,39.24 R22.2 | v47.05,76.39 R5.1 | ZD3.A 21.78,61.12 v22.8,61.19 | R2.1 v21.97,62.36 | C82.2 v21.27,11.3
  Top 0.305: C66.1 79.72,62.65 v79.69,62.67 | C6.1 20.87,13.31 v20.83,13.27 | C21.2 v56.01,24.26 | IC26.8 59.53,23.14 v59.5,23.18 | C22.2 62.52,25.88 v61.66,25.91 | C13.1 54.86,15.24 v54.93,15.3 | v54.42,17.08 C12.1 | IC28.10 70.7,26.45 70.23,26.92 70.23,27.09 C81.2 v69.15,27.3 | IC14.8 47.15,26.64 v47.24,26.86 | v42.23,75.69 42.01,75.69 IC4.1 | v16.64,75.69 16.42,75.69 IC17.1 | v9.34,76.83 10.03,76.83 C41.2 | v9.34,75.5 9.97,75.5 10.03,75.56 C40.2 | IC21.3 15.99,47.13 v15.88,47.24
  Top 0.406: v68.45,13.78 69.6,13.78 | R57.1 R56.1 R55.1 | IC23.7 70.52,78.88 C58.1 69.72,78.21 v68.77,78.21 | v74.42,79.73 74.42,79.62 IC23.TP | v41.59,20.83 41.59,19.72 IC10.54 | 39.94,19.81 IC10.52 39.98,18.7 v40.07,18.54 | v35.18,20.95 IC10.46 | v31.18,20.83 IC10.41 | v20.7,20.7 20.83,19.82 IC10.28 | C28.2 32.83,32.54 v32.64,31.94 32.78,31.8 IC10.12 | C27.2 v40.89,34.16 | C23.2 v25.78,32.58 | v49.66,53.47 C57.2 | C43.2 v45.4,56.2 | C39.2 v43.88,58.36 | C35.2 v28.64,57.56 | C46.2 v26.67,54.29 | C47.2 v24.7,52.58 | C38.2 v50.35,45.78 | C50.2 v48.13,43.81 | C48.2 v46.04,41.34 | C42.2 v44.32,41.02 | C49.2 v44.45,38.67 | C44.2 v37.85,34.42 | v31.81,36.07 C52.2 | v29.97,37.66 C45.2 | v28.26,38.42 C53.2 | v24.32,43.81 C37.2 | C33.1 12.99,14.71 v12.32,14.73 | IC16.1 11.24,18.67 v12.06,18.67 | v12.83,23.37 IC15.2 | XO2.2 v49.59,57.91 | C36.2 23.18,50.86 v23.11,50.8 | v16.51,43.43 16.51,44.16 C51.2 | C24.2 37.59,32.22 v37.59,31.88 37.58,31.86 IC10.6 | J1.5 7.76,15.67 9.4,14.03 v9.97,14.03 10.67,14.03 11.33,13.37 FB2.P$1 | IC2.1 28.85,76.05 v29.21,75.69 | v35.05,76.83 35.75,76.83 C9.2 | v35.05,75.44 35.75,75.44 C8.2 | v21.97,76.83 22.61,76.83 22.67,76.9 22.67,77.72 | v21.97,75.44 22.67,75.44 C4.2 | C11.1 v29.78,66.48 | C56.2 31.56,64.27 v31.56,64.52 | v42.48,7.94 41.47,7.94 41.12,8.29 | 41.12,8.29 41.08,8.32 | JP1.3 41.1,8.27 41.12,8.29 | v95.82,15.49 95.82,16.38 96.01,16.57 C77.2
  Ground 0.254: v85.53,18.73 86.42,18.73 | X1.3 2.04,63.8 2.03,63.82 | X1.1 6.91,60.53
  Bottom 0.152: v29.97,69.53 28.77,69.53 24.7,73.6 24.7,75.37 23.94,76.14 v23.37,76.14 | v42.93,69.53 41.21,69.53 37.85,72.9 37.85,75.56 37.27,76.14 v36.45,76.14 | v17.08,69.72 15.75,69.72 11.94,73.53 11.94,75.56 11.3,76.2 v10.73,76.2 | v83.63,18.48 83.63,18.98 J2.SW2
  Bottom 0.203: X9.2 94.11,37.15 v94.36,37.4 | X9.9 94.35,40.65 v94.36,40.64
  Bottom 0.254: X9.20 92,46.15 v91.76,45.91 92.02,45.65 X9.19
  Bottom 0.406: J2.S 96.33,13.04 v96.33,12.06 | J2.6 96.95,22.35 v97.98,22.35
  other vias: 96.84,15.49 73.6,79.73 73.6,78.65 74.42,78.65 64.39,59.63 13.46,6.73 36.32,48.01 33.53,48.01 36.32,45.21 39.12,48.01 34.99,46.55 37.78,46.67 37.72,49.47 36.32,50.8 34.99,49.47 31.56,61.28 7.94,8.38 14.16,6.73 14.86,6.73 21.97,76.14 23.37,76.83 23.37,75.44 35.05,76.14 36.45,76.83 36.45,75.44 29.21,76.39 22.8,60.3 42.23,76.39 40.83,83.44 39.56,78.42 45.02,73.47 31.94,73.47 26.48,78.42 27.75,83.5 45.02,83.44 45.02,78.42 31.94,78.42 19.11,73.47 31.94,83.5 19.11,83.5 15.11,83.5 13.65,78.42 19.11,78.42 10.73,76.83 10.73,75.5 9.33,76.14 16.64,76.39
  pour Ground (isolate 0.203): 0,84.84 99.82,84.84 99.82,0.25 0,0.25
  pour Top (isolate 0.203, no thermals): 13.21,8.26 13.53,8.26 14.29,9.02 16.19,9.02 16.19,7.62 15.75,7.62 15.18,7.05 15.18,6.48 13.21,6.48
  pour Bottom (isolate 0.254): 26.16,83.82 32.26,83.82 32.26,73.15 26.42,73.15 26.16,73.41
  pour Bottom (isolate 0.254): 39.24,83.82 45.34,83.82 45.34,73.15 39.24,73.15
  pour Bottom (isolate 0.254): 13.34,83.82 19.43,83.82 19.43,73.15 13.59,73.15 13.34,73.41
  pour Top (isolate 0.203, no thermals): 9.08,77.09 10.99,77.09 10.99,75.25 9.08,75.25
  pour Top (isolate 0.203, no thermals): 21.72,77.09 23.62,77.09 23.62,75.18 21.72,75.18
  pour Top (isolate 0.203, no thermals): 34.8,77.09 36.7,77.09 36.64,75.18 34.73,75.18
GPIO38  (via drill 0.3)
  Top 0.152: IC18.5 33.34,57.5 v33.34,57.59
  Bottom 0.152: v33.34,57.59 32.77,58.23 28.13,58.23 27.18,57.28 18.86,57.28 17.59,56.01 14.41,56.01 X4.3
GPIO39  (via drill 0.3)
  Top 0.152: IC18.7 33.12,56.58 32.38,56.58 v32.38,56.64
  Bottom 0.152: X4.1 16.83,54.74 18.99,56.9 31.81,56.9 32.07,56.64 v32.38,56.64
HOLE_DL  (via drill 3.2 pad 5.5)
  other vias: 3.5,3.5
HOLE_DR  (via drill 3.2 pad 5.5)
  other vias: 96.5,3.5
HOLE_UL  (via drill 3.2 pad 5.5)
  other vias: 3.5,81.5
HOLE_UR  (via drill 3.2 pad 5.5)
  other vias: 96.5,81.5
IOEXP_DINP1
  Top 0.254: ZD4.C 75.39,10.41 R58.2 76.2,13.84 73.95,16.09 IC28.24
IOEXP_DINP2  (via drill 0.3)
  Top 0.254: IC28.25 74.61,16.26 78.17,12.7 78.17,12 | R59.2 78.17,12 | ZD5.C 74.17,11.3 v74.87,12 | v77.53,12 78.17,12
  Bottom 0.254: v74.87,12 v77.53,12
IOEXP_DINP3  (via drill 0.3)
  Top 0.254: IC28.26 75.25,16.51 77.92,13.84 v78.36,13.84 80.14,12.06 R60.2 | v74.93,13.84 73.81,13.84 ZD6.C
  Bottom 0.254: v78.36,13.84 v74.93,13.84
IOEXP_LED1  (via drill 0.3)
  Top 0.254: IC28.21 72,17.07 v71.18,16.26 | v64.96,2.54 64.42,2.54 LED1.A
  Bottom 0.254: v71.18,16.26 71.18,8.76 v64.96,2.54
IOEXP_LED2  (via drill 0.3)
  Top 0.254: IC28.22 72.66,16.52 71.82,15.68 71.82,7.11 v71.31,6.6 | v69.03,2.16 68.11,2.16 LED2.A
  Bottom 0.254: v69.03,2.16 69.03,4.32 v71.31,6.6
IOEXP_OCI1
  Top 0.254: OK2.8 87.56,24.57 R66.1 86.34,25.29 IC28.1
IOEXP_OCI2
  Top 0.254: IC28.2 75.91,26.44 76.26,26.8 91.69,26.8 | OK2.6 91.69,26.8 | R65.1 94.81,25.91 93.92,26.8 91.69,26.8
IOEXP_OCO1
  Top 0.254: IC28.27 75.91,19.39 R61.2
IOEXP_OCO2
  Top 0.254: IC28.28 79.17,18.02 R62.2
IPEXP_LED3
  Top 0.254: IC28.23 73.29,16.33 72.39,15.43 72.39,5.91 73.22,5.08 73.22,3.2 LED3.A
LATCH_IN  (via drill 0.3)
  Top 0.152: IC11.9 49.95,20.23 v49.91,20.19 | X3.2 51.88,42.04 49.21,42.04 48.7,41.53 v48.7,40.96